# Altium project Altera256.PrjPcb
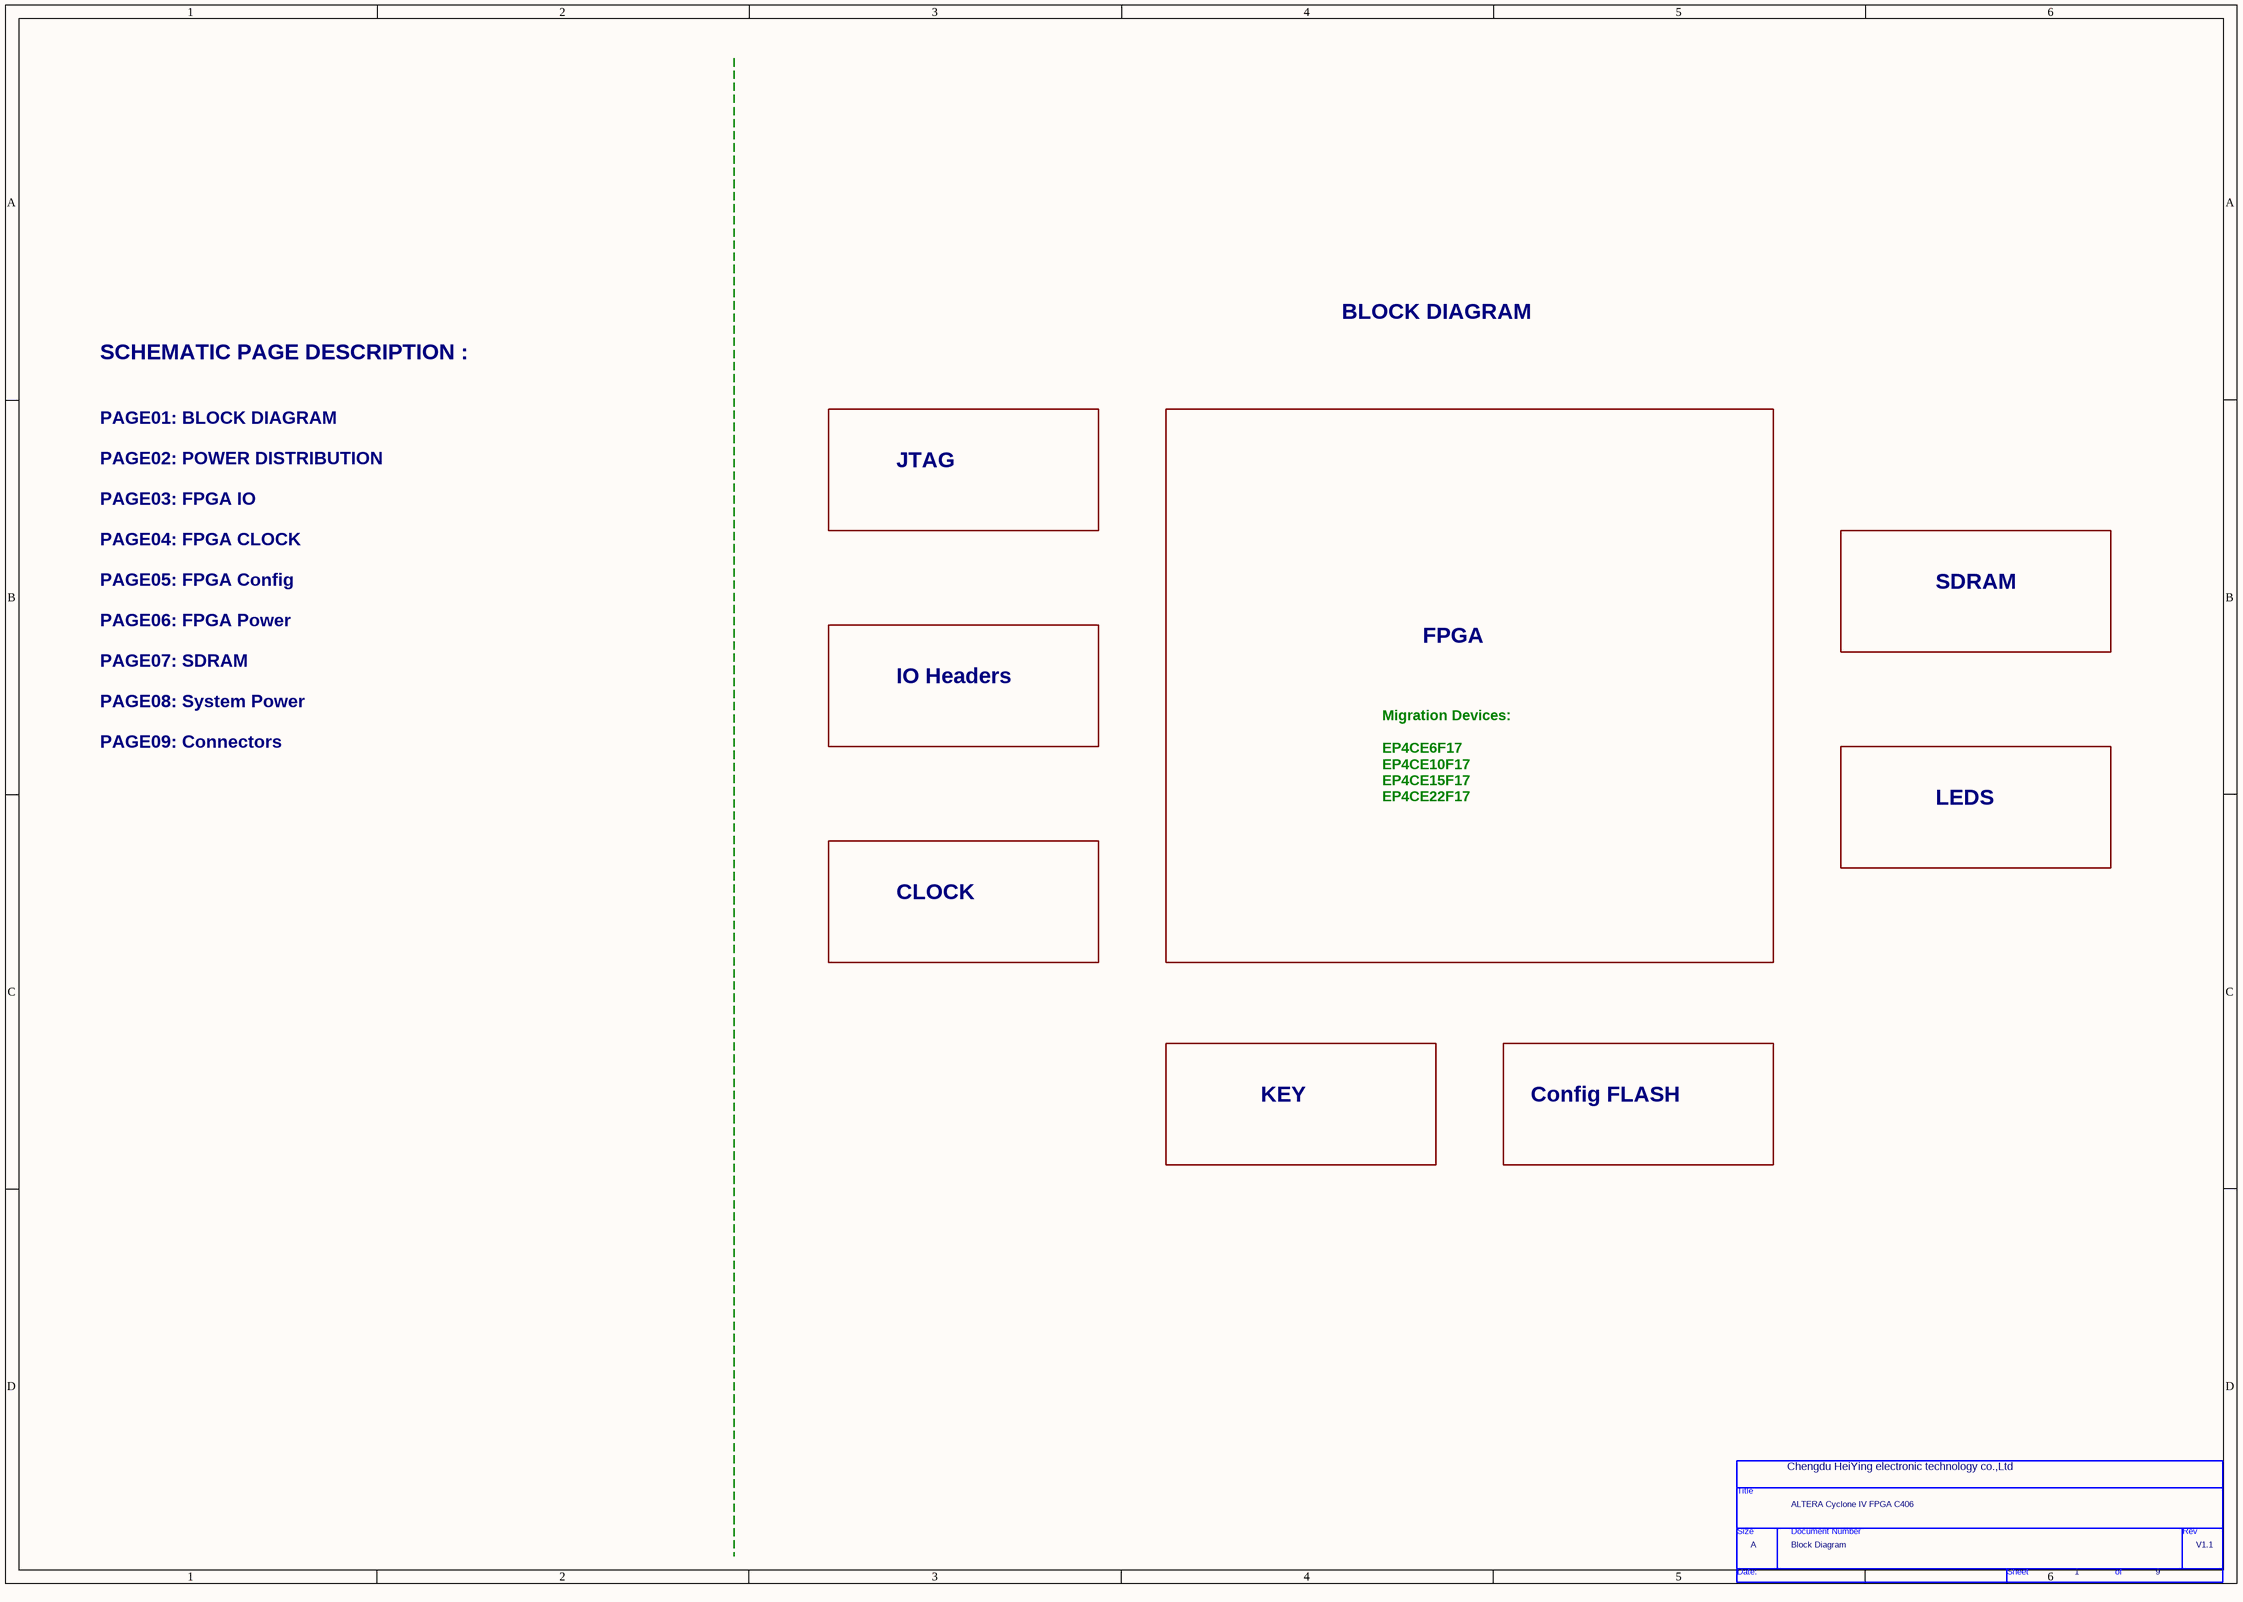
[diagram p0: PAGE01 BLOCK DIAGRAM.SchDoc]
9 sheets, 121 parts. Net scope: global (net labels, ports and power ports of the same name join across sheets).
Board file: C406_V163.PcbDoc
Sheets:
  PAGE01 BLOCK DIAGRAM.SchDoc
  PAGE02 POWER DISTRIBUTI.SchDoc
  PAGE03 FPGA IO.SchDoc
  PAGE04 FPGA CLOCK.SchDoc
  PAGE05 FPGA Config.SchDoc
  PAGE06 FPGA Power.SchDoc
  PAGE07 SDRAM.SchDoc
  PAGE08 System Power.SchDoc
  PAGE09 Connectors.SchDoc

## Sheet PAGE01 BLOCK DIAGRAM.SchDoc
size 420 x 297 mm; SheetNumber: 1; SheetTotal: 9

### Parts
(Parts that share a designator on the sheet are numbered #1, #2 ... from top to bottom, then left to right.)
*#1  Page Count: 9  Page Number: 1  Page Size: A  Title: ALTERA Cyclone IV FPGA C406  RevCode: V1.1  Doc: Block Diagram  (hidden comment: TitleBlock0)  (graphical)

### Notes on the sheet
- BLOCK DIAGRAM
- SCHEMATIC PAGE DESCRIPTION :
- PAGE01: BLOCK DIAGRAM
- PAGE02: POWER DISTRIBUTION
- PAGE03: FPGA IO
- JTAG
- PAGE04: FPGA CLOCK
- PAGE05: FPGA Config
- SDRAM
- PAGE06: FPGA Power
- PAGE07: SDRAM
- FPGA
- PAGE08: System Power
- IO Headers
- PAGE09: Connectors
- Migration Devices:
  EP4CE6F17
  EP4CE10F17
  EP4CE15F17
  EP4CE22F17
- LEDS
- CLOCK
- KEY
- Config FLASH
- (near *#1) Chengdu HeiYing electronic technology co.,Ltd
- (in symbol TitleBlock0) Title; Size; Document Number; Rev; Date:; Sheet; of

### Library data of the parts
*#1 = TitleBlock0: Page Create Date: March  8, 1995

## Sheet PAGE02 POWER DISTRIBUTI.SchDoc
size 420 x 297 mm; SheetNumber: 2; SheetTotal: 9
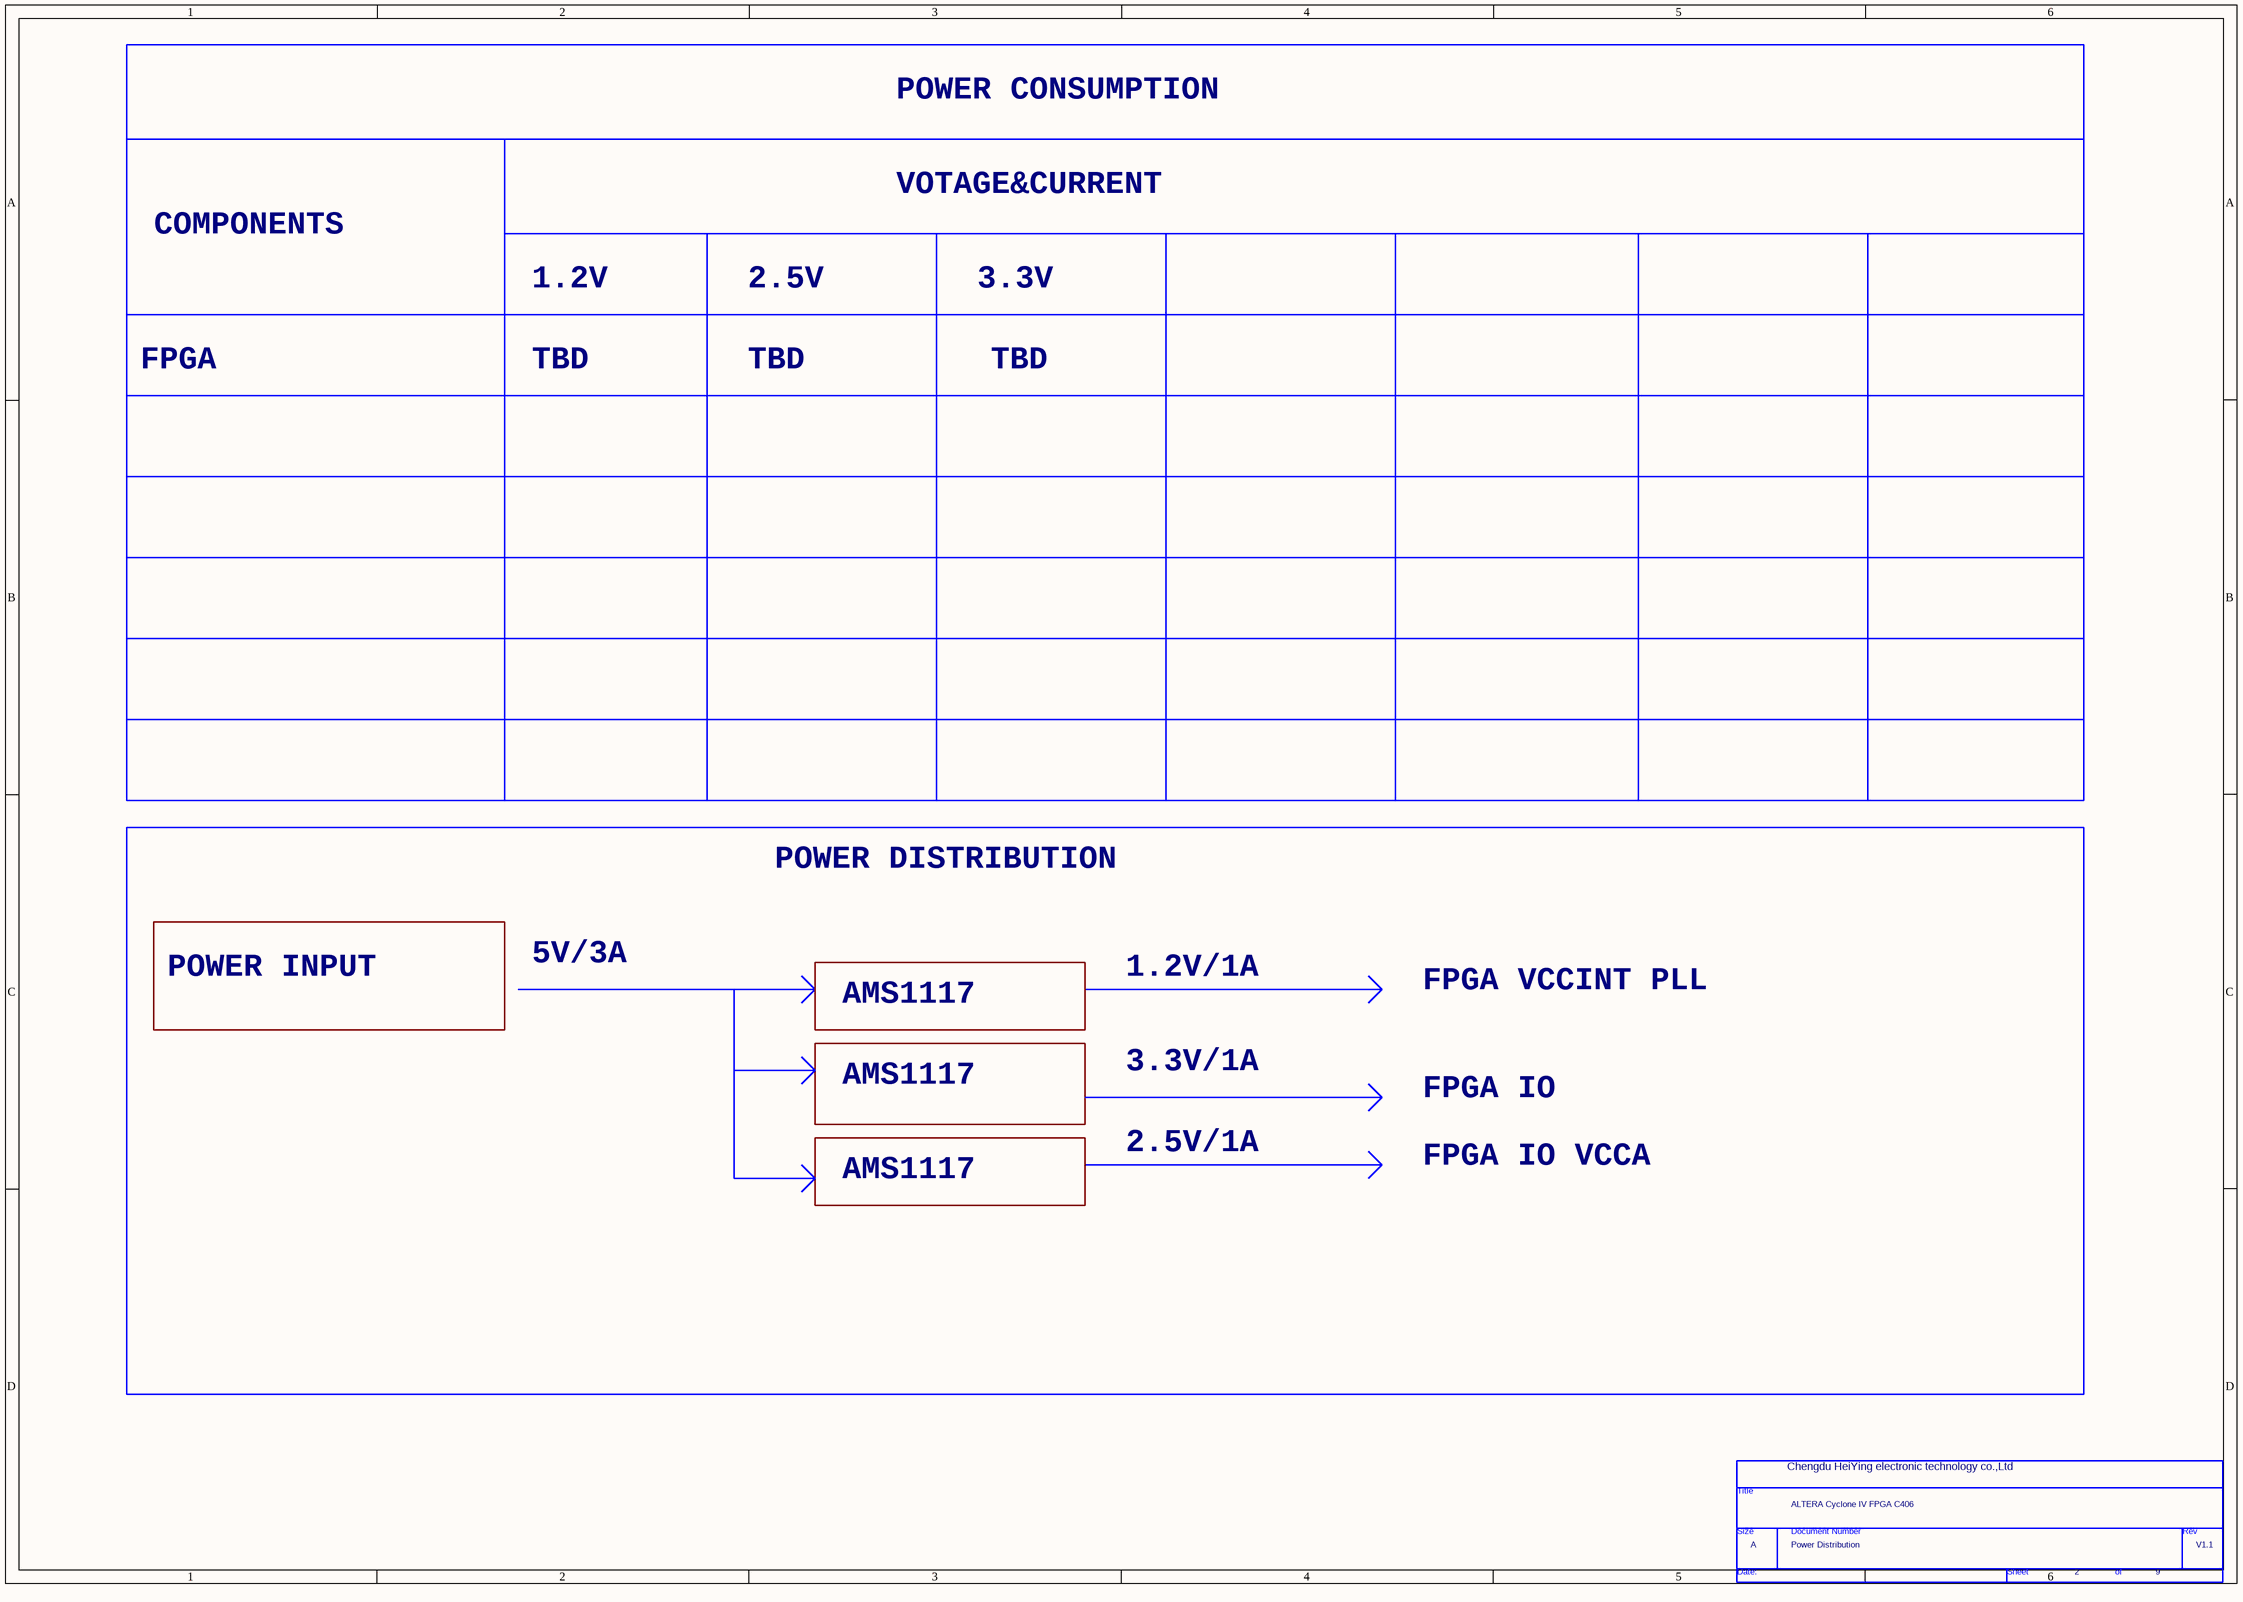
[diagram p1: PAGE02 POWER DISTRIBUTI.SchDoc]

### Parts
(Parts that share a designator on the sheet are numbered #1, #2 ... from top to bottom, then left to right.)
*#2  Page Count: 9  Page Number: 2  Page Size: A  Title: ALTERA Cyclone IV FPGA C406  RevCode: V1.1  Doc: Power Distribution  (hidden comment: TitleBlock0)  (graphical)

### Notes on the sheet
- POWER CONSUMPTION
- COMPONENTS
- VOTAGE&CURRENT
- 1.2V
- 2.5V
- 3.3V
- FPGA
- TBD
- POWER DISTRIBUTION
- POWER INPUT
- 5V/3A
- 1.2V/1A
- FPGA VCCINT PLL
- AMS1117
- 3.3V/1A
- FPGA IO
- 2.5V/1A
- FPGA IO VCCA
- (near *#2) Chengdu HeiYing electronic technology co.,Ltd
- (in symbol TitleBlock0) Title; Size; Document Number; Rev; Date:; Sheet; of

### Library data of the parts
*#2 = TitleBlock0: Page Create Date: March  8, 1995

## Sheet PAGE03 FPGA IO.SchDoc
size 420 x 297 mm; SheetNumber: 3; SheetTotal: 9
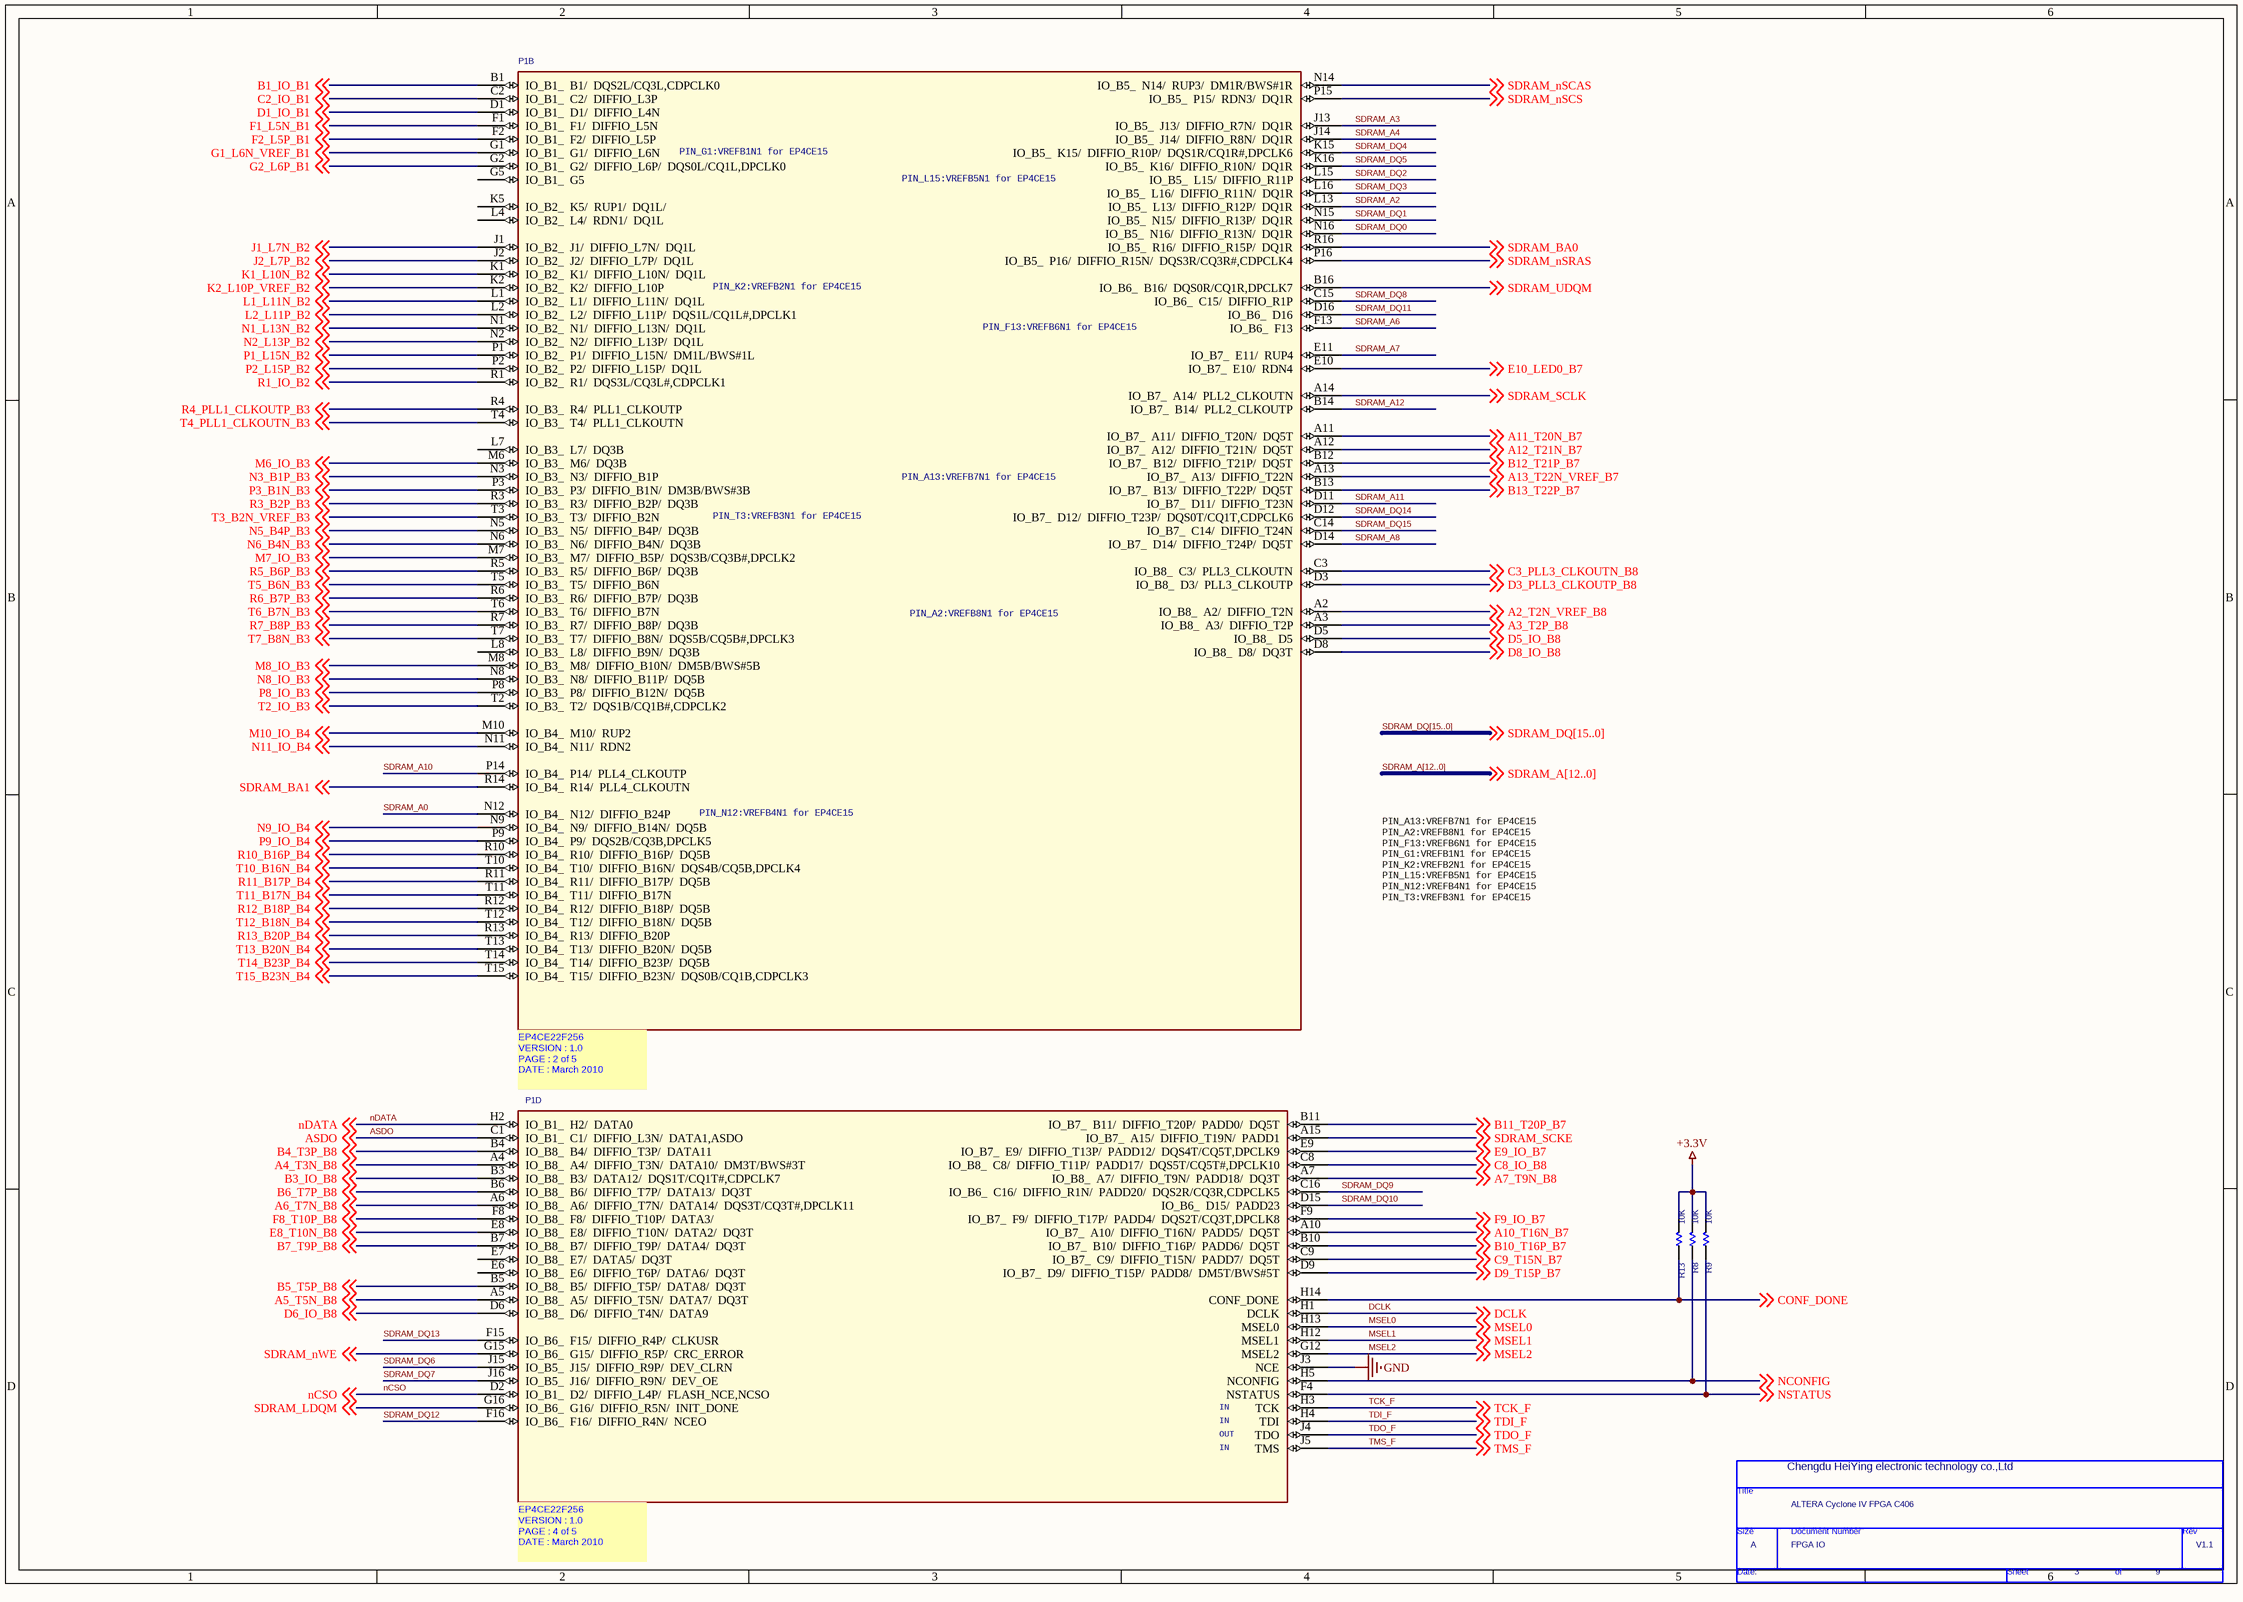
[diagram p2: PAGE03 FPGA IO.SchDoc]

### Parts
(Parts that share a designator on the sheet are numbered #1, #2 ... from top to bottom, then left to right.)
*#3  Page Count: 9  Page Number: 3  Page Size: A  Title: ALTERA Cyclone IV FPGA C406  RevCode: V1.1  Doc: FPGA IO  (hidden comment: TitleBlock0)  (graphical)
P1  EP4CE22F256  [fbga256_opt1]  (value not drawn)  (parts B,D of 5)
R8  10K  [R0402]
R9  10K  [R0402]
R13  10K  [R0402]

### Nets
+3.3V: R8.2 R9.2 R13.2
GND: P1.J3(NCE)
A2_T2N_VREF_B8: P1.A2(IO_B8___A2/__DIFFIO_T2N) ; off-sheet A2_T2N_VREF_B8
A3_T2P_B8: P1.A3(IO_B8___A3/__DIFFIO_T2P) ; off-sheet A3_T2P_B8
A4_T3N_B8: P1.A4(IO_B8___A4/__DIFFIO_T3N/__DATA10/__DM3T/BWS#3T) ; off-sheet A4_T3N_B8
A5_T5N_B8: P1.A5(IO_B8___A5/__DIFFIO_T5N/__DATA7/__DQ3T) ; off-sheet A5_T5N_B8
A6_T7N_B8: P1.A6(IO_B8___A6/__DIFFIO_T7N/__DATA14/__DQS3T/CQ3T#,DPCLK11) ; off-sheet A6_T7N_B8
A7_T9N_B8: P1.A7(IO_B8___A7/__DIFFIO_T9N/__PADD18/__DQ3T) ; off-sheet A7_T9N_B8
A10_T16N_B7: P1.A10(IO_B7___A10/__DIFFIO_T16N/__PADD5/__DQ5T) ; off-sheet A10_T16N_B7
A11_T20N_B7: P1.A11(IO_B7___A11/__DIFFIO_T20N/__DQ5T) ; off-sheet A11_T20N_B7
A12_T21N_B7: P1.A12(IO_B7___A12/__DIFFIO_T21N/__DQ5T) ; off-sheet A12_T21N_B7
A13_T22N_VREF_B7: P1.A13(IO_B7___A13/__DIFFIO_T22N) ; off-sheet A13_T22N_VREF_B7
ASDO: P1.C1(IO_B1___C1/__DIFFIO_L3N/__DATA1,ASDO) ; off-sheet ASDO
B1_IO_B1: P1.B1(IO_B1___B1/__DQS2L/CQ3L,CDPCLK0) ; off-sheet B1_IO_B1
B3_IO_B8: P1.B3(IO_B8___B3/__DATA12/__DQS1T/CQ1T#,CDPCLK7) ; off-sheet B3_IO_B8
B4_T3P_B8: P1.B4(IO_B8___B4/__DIFFIO_T3P/__DATA11) ; off-sheet B4_T3P_B8
B5_T5P_B8: P1.B5(IO_B8___B5/__DIFFIO_T5P/__DATA8/__DQ3T) ; off-sheet B5_T5P_B8
B6_T7P_B8: P1.B6(IO_B8___B6/__DIFFIO_T7P/__DATA13/__DQ3T) ; off-sheet B6_T7P_B8
B7_T9P_B8: P1.B7(IO_B8___B7/__DIFFIO_T9P/__DATA4/__DQ3T) ; off-sheet B7_T9P_B8
B10_T16P_B7: P1.B10(IO_B7___B10/__DIFFIO_T16P/__PADD6/__DQ5T) ; off-sheet B10_T16P_B7
B11_T20P_B7: P1.B11(IO_B7___B11/__DIFFIO_T20P/__PADD0/__DQ5T) ; off-sheet B11_T20P_B7
B12_T21P_B7: P1.B12(IO_B7___B12/__DIFFIO_T21P/__DQ5T) ; off-sheet B12_T21P_B7
B13_T22P_B7: P1.B13(IO_B7___B13/__DIFFIO_T22P/__DQ5T) ; off-sheet B13_T22P_B7
C2_IO_B1: P1.C2(IO_B1___C2/__DIFFIO_L3P) ; off-sheet C2_IO_B1
C3_PLL3_CLKOUTN_B8: P1.C3(IO_B8___C3/__PLL3_CLKOUTN) ; off-sheet C3_PLL3_CLKOUTN_B8
C8_IO_B8: P1.C8(IO_B8___C8/__DIFFIO_T11P/__PADD17/__DQS5T/CQ5T#,DPCLK10) ; off-sheet C8_IO_B8
C9_T15N_B7: P1.C9(IO_B7___C9/__DIFFIO_T15N/__PADD7/__DQ5T) ; off-sheet C9_T15N_B7
CONF_DONE: P1.H14(CONF_DONE) R13.1 ; off-sheet CONF_DONE
D1_IO_B1: P1.D1(IO_B1___D1/__DIFFIO_L4N) ; off-sheet D1_IO_B1
D3_PLL3_CLKOUTP_B8: P1.D3(IO_B8___D3/__PLL3_CLKOUTP) ; off-sheet D3_PLL3_CLKOUTP_B8
D5_IO_B8: P1.D5(IO_B8___D5) ; off-sheet D5_IO_B8
D6_IO_B8: P1.D6(IO_B8___D6/__DIFFIO_T4N/__DATA9) ; off-sheet D6_IO_B8
D8_IO_B8: P1.D8(IO_B8___D8/__DQ3T) ; off-sheet D8_IO_B8
D9_T15P_B7: P1.D9(IO_B7___D9/__DIFFIO_T15P/__PADD8/__DM5T/BWS#5T) ; off-sheet D9_T15P_B7
DCLK: P1.H1(DCLK) ; off-sheet DCLK
E8_T10N_B8: P1.E8(IO_B8___E8/__DIFFIO_T10N/__DATA2/__DQ3T) ; off-sheet E8_T10N_B8
E9_IO_B7: P1.E9(IO_B7___E9/__DIFFIO_T13P/__PADD12/__DQS4T/CQ5T,DPCLK9) ; off-sheet E9_IO_B7
E10_LED0_B7: P1.E10(IO_B7___E10/__RDN4) ; off-sheet E10_LED0_B7
F1_L5N_B1: P1.F1(IO_B1___F1/__DIFFIO_L5N) ; off-sheet F1_L5N_B1
F2_L5P_B1: P1.F2(IO_B1___F2/__DIFFIO_L5P) ; off-sheet F2_L5P_B1
F8_T10P_B8: P1.F8(IO_B8___F8/__DIFFIO_T10P/__DATA3/) ; off-sheet F8_T10P_B8
F9_IO_B7: P1.F9(IO_B7___F9/__DIFFIO_T17P/__PADD4/__DQS2T/CQ3T,DPCLK8) ; off-sheet F9_IO_B7
G1_L6N_VREF_B1: P1.G1(IO_B1___G1/__DIFFIO_L6N) ; off-sheet G1_L6N_VREF_B1
G2_L6P_B1: P1.G2(IO_B1___G2/__DIFFIO_L6P/__DQS0L/CQ1L,DPCLK0) ; off-sheet G2_L6P_B1
J1_L7N_B2: P1.J1(IO_B2___J1/__DIFFIO_L7N/__DQ1L) ; off-sheet J1_L7N_B2
J2_L7P_B2: P1.J2(IO_B2___J2/__DIFFIO_L7P/__DQ1L) ; off-sheet J2_L7P_B2
K1_L10N_B2: P1.K1(IO_B2___K1/__DIFFIO_L10N/__DQ1L) ; off-sheet K1_L10N_B2
K2_L10P_VREF_B2: P1.K2(IO_B2___K2/__DIFFIO_L10P) ; off-sheet K2_L10P_VREF_B2
L1_L11N_B2: P1.L1(IO_B2___L1/__DIFFIO_L11N/__DQ1L) ; off-sheet L1_L11N_B2
L2_L11P_B2: P1.L2(IO_B2___L2/__DIFFIO_L11P/__DQS1L/CQ1L#,DPCLK1) ; off-sheet L2_L11P_B2
M6_IO_B3: P1.M6(IO_B3___M6/__DQ3B) ; off-sheet M6_IO_B3
M7_IO_B3: P1.M7(IO_B3___M7/__DIFFIO_B5P/__DQS3B/CQ3B#,DPCLK2) ; off-sheet M7_IO_B3
M8_IO_B3: P1.M8(IO_B3___M8/__DIFFIO_B10N/__DM5B/BWS#5B) ; off-sheet M8_IO_B3
M10_IO_B4: P1.M10(IO_B4___M10/__RUP2) ; off-sheet M10_IO_B4
MSEL0: P1.H13(MSEL0) ; off-sheet MSEL0
MSEL1: P1.H12(MSEL1) ; off-sheet MSEL1
MSEL2: P1.G12(MSEL2) ; off-sheet MSEL2
N1_L13N_B2: P1.N1(IO_B2___N1/__DIFFIO_L13N/__DQ1L) ; off-sheet N1_L13N_B2
N2_L13P_B2: P1.N2(IO_B2___N2/__DIFFIO_L13P/__DQ1L) ; off-sheet N2_L13P_B2
N3_B1P_B3: P1.N3(IO_B3___N3/__DIFFIO_B1P) ; off-sheet N3_B1P_B3
N5_B4P_B3: P1.N5(IO_B3___N5/__DIFFIO_B4P/__DQ3B) ; off-sheet N5_B4P_B3
N6_B4N_B3: P1.N6(IO_B3___N6/__DIFFIO_B4N/__DQ3B) ; off-sheet N6_B4N_B3
N8_IO_B3: P1.N8(IO_B3___N8/__DIFFIO_B11P/__DQ5B) ; off-sheet N8_IO_B3
N9_IO_B4: P1.N9(IO_B4___N9/__DIFFIO_B14N/__DQ5B) ; off-sheet N9_IO_B4
N11_IO_B4: P1.N11(IO_B4___N11/__RDN2) ; off-sheet N11_IO_B4
NCONFIG: P1.H5(NCONFIG) R8.1 ; off-sheet NCONFIG
nCSO: P1.D2(IO_B1___D2/__DIFFIO_L4P/__FLASH_NCE,NCSO) ; off-sheet nCSO
nDATA: P1.H2(IO_B1___H2/__DATA0) ; off-sheet nDATA
NSTATUS: P1.F4(NSTATUS) R9.1 ; off-sheet NSTATUS
P1_L15N_B2: P1.P1(IO_B2___P1/__DIFFIO_L15N/__DM1L/BWS#1L) ; off-sheet P1_L15N_B2
P2_L15P_B2: P1.P2(IO_B2___P2/__DIFFIO_L15P/__DQ1L) ; off-sheet P2_L15P_B2
P3_B1N_B3: P1.P3(IO_B3___P3/__DIFFIO_B1N/__DM3B/BWS#3B) ; off-sheet P3_B1N_B3
P8_IO_B3: P1.P8(IO_B3___P8/__DIFFIO_B12N/__DQ5B) ; off-sheet P8_IO_B3
P9_IO_B4: P1.P9(IO_B4___P9/__DQS2B/CQ3B,DPCLK5) ; off-sheet P9_IO_B4
R1_IO_B2: P1.R1(IO_B2___R1/__DQS3L/CQ3L#,CDPCLK1) ; off-sheet R1_IO_B2
R3_B2P_B3: P1.R3(IO_B3___R3/__DIFFIO_B2P/__DQ3B) ; off-sheet R3_B2P_B3
R4_PLL1_CLKOUTP_B3: P1.R4(IO_B3___R4/__PLL1_CLKOUTP) ; off-sheet R4_PLL1_CLKOUTP_B3
R5_B6P_B3: P1.R5(IO_B3___R5/__DIFFIO_B6P/__DQ3B) ; off-sheet R5_B6P_B3
R6_B7P_B3: P1.R6(IO_B3___R6/__DIFFIO_B7P/__DQ3B) ; off-sheet R6_B7P_B3
R7_B8P_B3: P1.R7(IO_B3___R7/__DIFFIO_B8P/__DQ3B) ; off-sheet R7_B8P_B3
R10_B16P_B4: P1.R10(IO_B4___R10/__DIFFIO_B16P/__DQ5B) ; off-sheet R10_B16P_B4
R11_B17P_B4: P1.R11(IO_B4___R11/__DIFFIO_B17P/__DQ5B) ; off-sheet R11_B17P_B4
R12_B18P_B4: P1.R12(IO_B4___R12/__DIFFIO_B18P/__DQ5B) ; off-sheet R12_B18P_B4
R13_B20P_B4: P1.R13(IO_B4___R13/__DIFFIO_B20P) ; off-sheet R13_B20P_B4
SDRAM_A0: P1.N12(IO_B4___N12/__DIFFIO_B24P)
SDRAM_A2: P1.L13(IO_B5___L13/__DIFFIO_R12P/__DQ1R)
SDRAM_A3: P1.J13(IO_B5___J13/__DIFFIO_R7N/__DQ1R)
SDRAM_A4: P1.J14(IO_B5___J14/__DIFFIO_R8N/__DQ1R)
SDRAM_A6: P1.F13(IO_B6___F13)
SDRAM_A7: P1.E11(IO_B7___E11/__RUP4)
SDRAM_A8: P1.D14(IO_B7___D14/__DIFFIO_T24P/__DQ5T)
SDRAM_A10: P1.P14(IO_B4___P14/__PLL4_CLKOUTP)
SDRAM_A11: P1.D11(IO_B7___D11/__DIFFIO_T23N)
SDRAM_A12: P1.B14(IO_B7___B14/__PLL2_CLKOUTP)
SDRAM_BA0: P1.R16(IO_B5___R16/__DIFFIO_R15P/__DQ1R) ; off-sheet SDRAM_BA0
SDRAM_BA1: P1.R14(IO_B4___R14/__PLL4_CLKOUTN) ; off-sheet SDRAM_BA1
SDRAM_DQ0: P1.N16(IO_B5___N16/__DIFFIO_R13N/__DQ1R)
SDRAM_DQ1: P1.N15(IO_B5___N15/__DIFFIO_R13P/__DQ1R)
SDRAM_DQ2: P1.L15(IO_B5___L15/__DIFFIO_R11P)
SDRAM_DQ3: P1.L16(IO_B5___L16/__DIFFIO_R11N/__DQ1R)
SDRAM_DQ4: P1.K15(IO_B5___K15/__DIFFIO_R10P/__DQS1R/CQ1R#,DPCLK6)
SDRAM_DQ5: P1.K16(IO_B5___K16/__DIFFIO_R10N/__DQ1R)
SDRAM_DQ6: P1.J15(IO_B5___J15/__DIFFIO_R9P/__DEV_CLRN)
SDRAM_DQ7: P1.J16(IO_B5___J16/__DIFFIO_R9N/__DEV_OE)
SDRAM_DQ8: P1.C15(IO_B6___C15/__DIFFIO_R1P)
SDRAM_DQ9: P1.C16(IO_B6___C16/__DIFFIO_R1N/__PADD20/__DQS2R/CQ3R,CDPCLK5)
SDRAM_DQ10: P1.D15(IO_B6___D15/__PADD23)
SDRAM_DQ11: P1.D16(IO_B6___D16)
SDRAM_DQ12: P1.F16(IO_B6___F16/__DIFFIO_R4N/__NCEO)
SDRAM_DQ13: P1.F15(IO_B6___F15/__DIFFIO_R4P/__CLKUSR)
SDRAM_DQ14: P1.D12(IO_B7___D12/__DIFFIO_T23P/__DQS0T/CQ1T,CDPCLK6)
SDRAM_DQ15: P1.C14(IO_B7___C14/__DIFFIO_T24N)
SDRAM_LDQM: P1.G16(IO_B6___G16/__DIFFIO_R5N/__INIT_DONE) ; off-sheet SDRAM_LDQM
SDRAM_nSCAS: P1.N14(IO_B5___N14/__RUP3/__DM1R/BWS#1R) ; off-sheet SDRAM_nSCAS
SDRAM_nSCS: P1.P15(IO_B5___P15/__RDN3/__DQ1R) ; off-sheet SDRAM_nSCS
SDRAM_nSRAS: P1.P16(IO_B5___P16/__DIFFIO_R15N/__DQS3R/CQ3R#,CDPCLK4) ; off-sheet SDRAM_nSRAS
SDRAM_nWE: P1.G15(IO_B6___G15/__DIFFIO_R5P/__CRC_ERROR) ; off-sheet SDRAM_nWE
SDRAM_SCKE: P1.A15(IO_B7___A15/__DIFFIO_T19N/__PADD1) ; off-sheet SDRAM_SCKE
SDRAM_SCLK: P1.A14(IO_B7___A14/__PLL2_CLKOUTN) ; off-sheet SDRAM_SCLK
SDRAM_UDQM: P1.B16(IO_B6___B16/__DQS0R/CQ1R,DPCLK7) ; off-sheet SDRAM_UDQM
T2_IO_B3: P1.T2(IO_B3___T2/__DQS1B/CQ1B#,CDPCLK2) ; off-sheet T2_IO_B3
T3_B2N_VREF_B3: P1.T3(IO_B3___T3/__DIFFIO_B2N) ; off-sheet T3_B2N_VREF_B3
T4_PLL1_CLKOUTN_B3: P1.T4(IO_B3___T4/__PLL1_CLKOUTN) ; off-sheet T4_PLL1_CLKOUTN_B3
T5_B6N_B3: P1.T5(IO_B3___T5/__DIFFIO_B6N) ; off-sheet T5_B6N_B3
T6_B7N_B3: P1.T6(IO_B3___T6/__DIFFIO_B7N) ; off-sheet T6_B7N_B3
T7_B8N_B3: P1.T7(IO_B3___T7/__DIFFIO_B8N/__DQS5B/CQ5B#,DPCLK3) ; off-sheet T7_B8N_B3
T10_B16N_B4: P1.T10(IO_B4___T10/__DIFFIO_B16N/__DQS4B/CQ5B,DPCLK4) ; off-sheet T10_B16N_B4
T11_B17N_B4: P1.T11(IO_B4___T11/__DIFFIO_B17N) ; off-sheet T11_B17N_B4
T12_B18N_B4: P1.T12(IO_B4___T12/__DIFFIO_B18N/__DQ5B) ; off-sheet T12_B18N_B4
T13_B20N_B4: P1.T13(IO_B4___T13/__DIFFIO_B20N/__DQ5B) ; off-sheet T13_B20N_B4
T14_B23P_B4: P1.T14(IO_B4___T14/__DIFFIO_B23P/__DQ5B) ; off-sheet T14_B23P_B4
T15_B23N_B4: P1.T15(IO_B4___T15/__DIFFIO_B23N/__DQS0B/CQ1B,CDPCLK3) ; off-sheet T15_B23N_B4
TCK_F: P1.H3(TCK) ; off-sheet TCK_F
TDI_F: P1.H4(TDI) ; off-sheet TDI_F
TDO_F: P1.J4(TDO) ; off-sheet TDO_F
TMS_F: P1.J5(TMS) ; off-sheet TMS_F

Not connected (* = marked no-connect by the designer): P1 E6(IO_B8___E6/__DIFFIO_T6P/__DATA6/__DQ3T) E7(IO_B8___E7/__DATA5/__DQ3T) G5(IO_B1___G5) K5(IO_B2___K5/__RUP1/__DQ1L/) L4(IO_B2___L4/__RDN1/__DQ1L) L7(IO_B3___L7/__DQ3B) L8(IO_B3___L8/__DIFFIO_B9N/__DQ3B)

### Buses and harness runs
bus SDRAM_A[12..0]
bus SDRAM_DQ[15..0]

### Notes on the sheet
- (near P1) PIN_G1:VREFB1N1 for EP4CE15
- (near P1) PIN_L15:VREFB5N1 for EP4CE15
- (near P1) PIN_K2:VREFB2N1 for EP4CE15
- (near P1) PIN_F13:VREFB6N1 for EP4CE15
- (near P1) PIN_T3:VREFB3N1 for EP4CE15
- (near P1) PIN_A13:VREFB7N1 for EP4CE15
- (near P1) PIN_A2:VREFB8N1 for EP4CE15
- (near P1) PIN_N12:VREFB4N1 for EP4CE15
- PIN_A13:VREFB7N1 for EP4CE15
  PIN_A2:VREFB8N1 for EP4CE15
  PIN_F13:VREFB6N1 for EP4CE15
  PIN_G1:VREFB1N1 for EP4CE15
  PIN_K2:VREFB2N1 for EP4CE15
  PIN_L15:VREFB5N1 for EP4CE15
  PIN_N12:VREFB4N1 for EP4CE15
  PIN_T3:VREFB3N1 for EP4CE15
- (near P1) IN
- (near P1) OUT
- (near *#3) Chengdu HeiYing electronic technology co.,Ltd
- (in symbol EP4CE22F256, part B) EP4CE22F256 / VERSION : 1.0 / PAGE : 2 of 5 / DATE : March 2010 /
- (in symbol EP4CE22F256, part D) EP4CE22F256 / VERSION : 1.0 / PAGE : 4 of 5 / DATE : March 2010 /
- (in symbol TitleBlock0) Title; Size; Document Number; Rev; Date:; Sheet; of

### Library data of the parts
P1 = EP4CE22F256: SWAP_INFO: (S1+S2+S3+S4+S5); SPLIT_INST: TRUE
R8 R9 R13 = SMALL R1
*#3 = TitleBlock0: Page Create Date: March  8, 1995

## Sheet PAGE04 FPGA CLOCK.SchDoc
size 246 x 182 mm; SheetNumber: 4; SheetTotal: 9
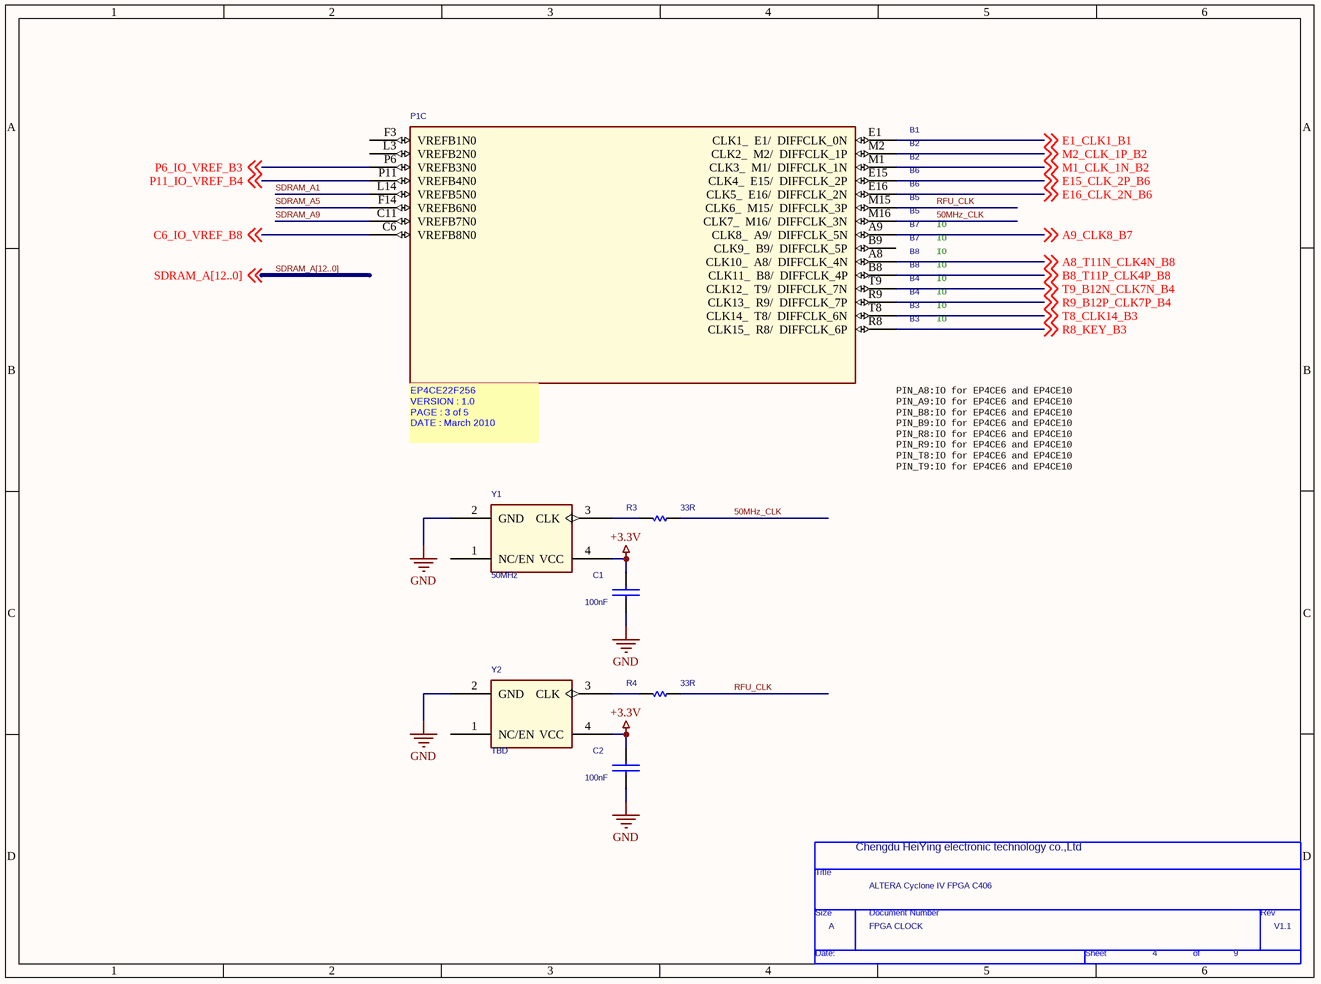
[diagram p3: PAGE04 FPGA CLOCK.SchDoc]

### Parts
(Parts that share a designator on the sheet are numbered #1, #2 ... from top to bottom, then left to right.)
*#4  Page Count: 9  Page Number: 4  Page Size: A  Title: ALTERA Cyclone IV FPGA C406  RevCode: V1.1  Doc: FPGA CLOCK  (hidden comment: TitleBlock0)  (graphical)
C1  100nF  [C0402]
C2  100nF  [C0402]
P1  EP4CE22F256  [fbga256_opt1]  (value not drawn)  (part C of 5)
R3  33R  [R0402]
R4  33R  [R0402]
Y1  50MHz  [OSC3225]
Y2  TBD  [OSC3225]

### Nets
+3.3V: C1.1 C2.1 Y1.4(VCC) Y2.4(VCC)
GND: C1.2 C2.2 Y1.2(GND) Y2.2(GND)
50MHz_CLK: P1.M16(CLK7___M16/__DIFFCLK_3N) R3.1
A8_T11N_CLK4N_B8: P1.A8(CLK10___A8/__DIFFCLK_4N) ; off-sheet A8_T11N_CLK4N_B8
A9_CLK8_B7: P1.A9(CLK8___A9/__DIFFCLK_5N) ; off-sheet A9_CLK8_B7
B8_T11P_CLK4P_B8: P1.B8(CLK11___B8/__DIFFCLK_4P) ; off-sheet B8_T11P_CLK4P_B8
C6_IO_VREF_B8: P1.C6(VREFB8N0) ; off-sheet C6_IO_VREF_B8
E1_CLK1_B1: P1.E1(CLK1___E1/__DIFFCLK_0N) ; off-sheet E1_CLK1_B1
E15_CLK_2P_B6: P1.E15(CLK4___E15/__DIFFCLK_2P) ; off-sheet E15_CLK_2P_B6
E16_CLK_2N_B6: P1.E16(CLK5___E16/__DIFFCLK_2N) ; off-sheet E16_CLK_2N_B6
M1_CLK_1N_B2: P1.M1(CLK3___M1/__DIFFCLK_1N) ; off-sheet M1_CLK_1N_B2
M2_CLK_1P_B2: P1.M2(CLK2___M2/__DIFFCLK_1P) ; off-sheet M2_CLK_1P_B2
P6_IO_VREF_B3: P1.P6(VREFB3N0) ; off-sheet P6_IO_VREF_B3
P11_IO_VREF_B4: P1.P11(VREFB4N0) ; off-sheet P11_IO_VREF_B4
R8_KEY_B3: P1.R8(CLK15___R8/__DIFFCLK_6P) ; off-sheet R8_KEY_B3
R9_B12P_CLK7P_B4: P1.R9(CLK13___R9/__DIFFCLK_7P) ; off-sheet R9_B12P_CLK7P_B4
RFU_CLK: P1.M15(CLK6___M15/__DIFFCLK_3P) R4.1
SDRAM_A1: P1.L14(VREFB5N0)
SDRAM_A5: P1.F14(VREFB6N0)
SDRAM_A9: P1.C11(VREFB7N0)
T8_CLK14_B3: P1.T8(CLK14___T8/__DIFFCLK_6N) ; off-sheet T8_CLK14_B3
T9_B12N_CLK7N_B4: P1.T9(CLK12___T9/__DIFFCLK_7N) ; off-sheet T9_B12N_CLK7N_B4
NetR3_2: R3.2 Y1.3(CLK)
NetR4_2: R4.2 Y2.3(CLK)

Not connected (* = marked no-connect by the designer): P1 B9(CLK9___B9/__DIFFCLK_5P) F3(VREFB1N0) L3(VREFB2N0); Y1 1(NC/EN); Y2 1(NC/EN)

### Buses and harness runs
bus SDRAM_A[12..0]

### Notes on the sheet
- B1
- B2
- B6
- B5
- B7
- B8
- IO
- B4
- B3
- PIN_A8:IO for EP4CE6 and EP4CE10
  PIN_A9:IO for EP4CE6 and EP4CE10
  PIN_B8:IO for EP4CE6 and EP4CE10
  PIN_B9:IO for EP4CE6 and EP4CE10
  PIN_R8:IO for EP4CE6 and EP4CE10
  PIN_R9:IO for EP4CE6 and EP4CE10
  PIN_T8:IO for EP4CE6 and EP4CE10
  PIN_T9:IO for EP4CE6 and EP4CE10
- (near *#4) Chengdu HeiYing electronic technology co.,Ltd
- (in symbol EP4CE22F256, part C) EP4CE22F256 / VERSION : 1.0 / PAGE : 3 of 5 / DATE : March 2010 /
- (in symbol TitleBlock0) Title; Size; Document Number; Rev; Date:; Sheet; of

### Library data of the parts
C1 C2 = CAP_0: CAP CER .1UF 16V X7R 0402; MANUFACTURER: MURATA; MANUFACTURER P/N: GRM155R71C104KA88D; ROOM: PHY&FPGA; DISTRIBUTOR: DIGIKEY; PRICE: 0.00300; DIELECTRIC: X7R; DISTRIBUTOR P/N: 490-3261-1-ND
P1 = EP4CE22F256: as P1 on sheet PAGE03 FPGA IO
R3 R4 = SMALL R1
Y1 Y2 = OSCILLATOR_0: ROOM: PHY&FPGA
*#4 = TitleBlock0: Page Create Date: March  8, 1995

## Sheet PAGE05 FPGA Config.SchDoc
size 297 x 209 mm; SheetNumber: 5; SheetTotal: 9
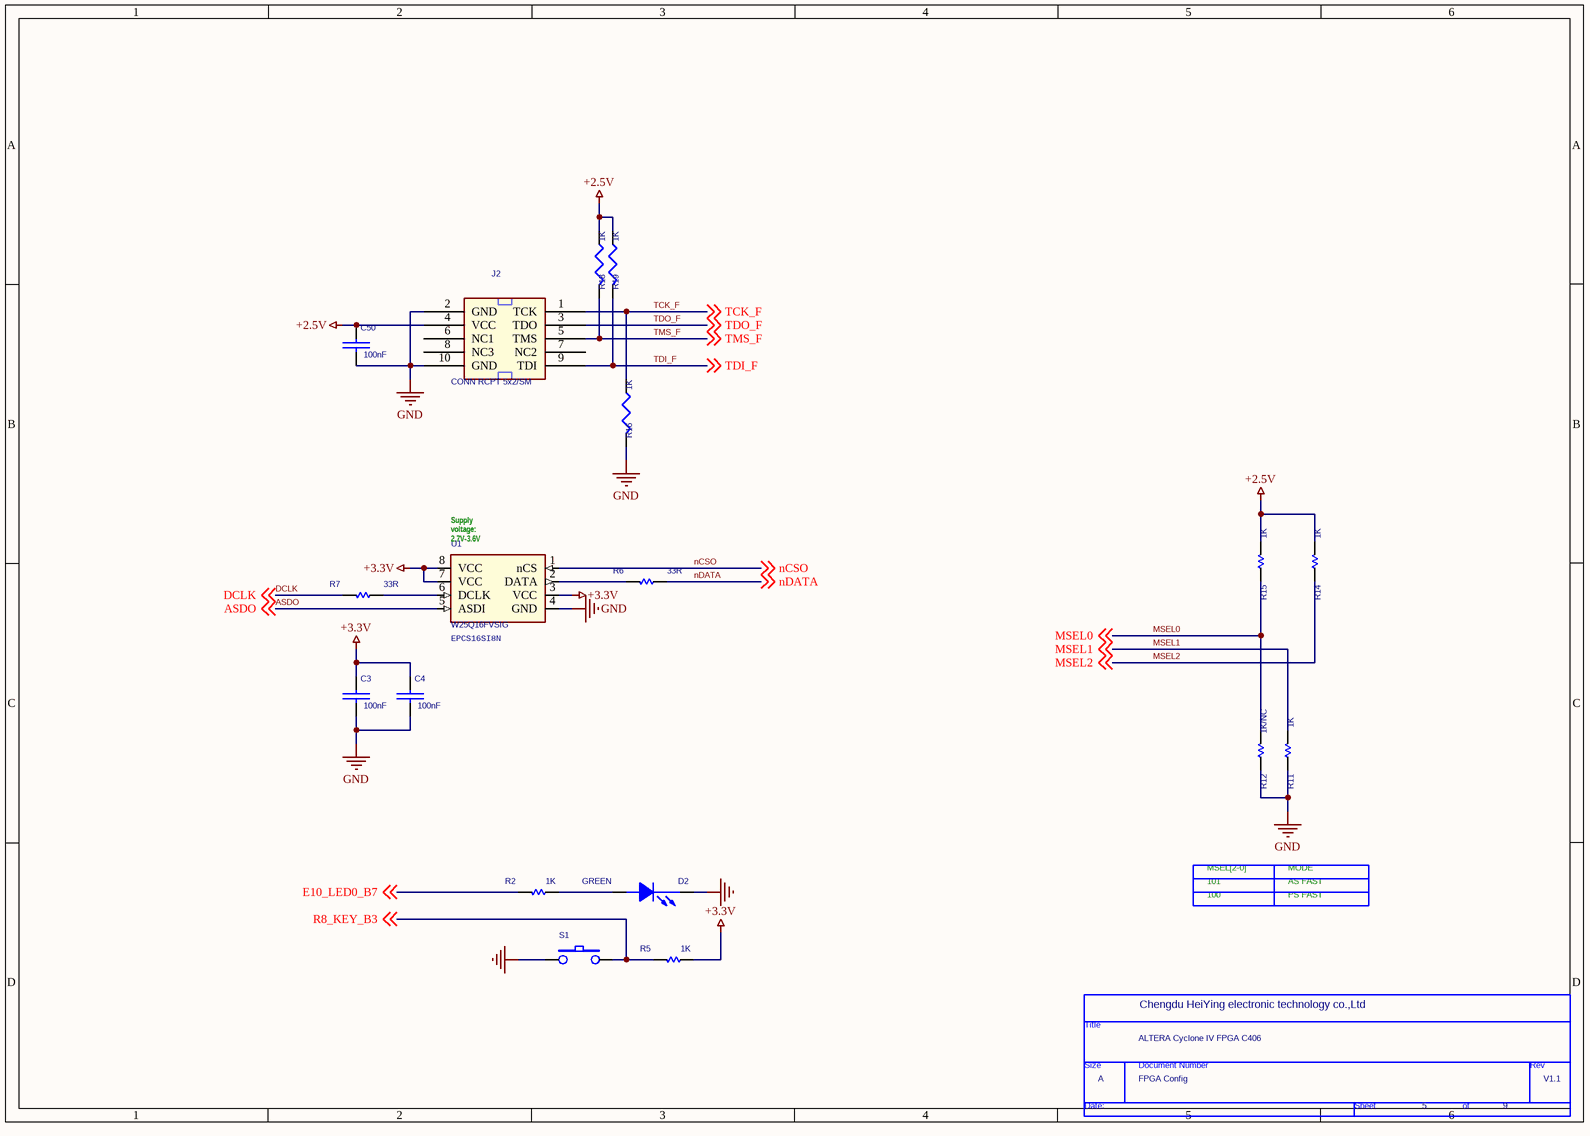
[diagram p4: PAGE05 FPGA Config.SchDoc]

### Parts
(Parts that share a designator on the sheet are numbered #1, #2 ... from top to bottom, then left to right.)
*#5  Page Count: 9  Page Number: 5  Page Size: A  Title: ALTERA Cyclone IV FPGA C406  RevCode: V1.1  Doc: FPGA Config  (hidden comment: TitleBlock0)  (graphical)
C3  100nF  [C0402]
C4  100nF  [C0402]
C50  100nF  [C0402]
D2  GREEN  [Q0603]
J2  CONN RCPT 5x2/SM  [DIP10-2P54-I]
R2  1K  [R0402]
R5  1K  [R0402]
R6  33R  [R0402]
R7  33R  [R0402]
R11  1K  [R0402]
R12  1K/NC  [R0402]
R14  1K  [R0402]
R15  1K  [R0402]
R16  1K  [R0402]
R18  1K  [R0402]
R19  1K  [R0402]
S1  FSMRA2JH  [SMD_3X4X2MM]  (value not drawn)
U1  W25Q16FVSIG  [SOIC8_1P27_208MIL]

### Nets
+2.5V: C50.1 J2.4(VCC) R14.2 R15.2 R18.1 R19.1
+3.3V: C3.1 C4.1 R5.1 U1.3(VCC) U1.7(VCC) U1.8(VCC)
GND: C3.2 C4.2 C50.2 D2.2(CATHODE) J2.2(GND) J2.10(GND) R11.1 R12.1 R16.2 S1.2 U1.4(GND)
ASDO: U1.5(ASDI) ; off-sheet ASDO
DCLK: R7.2 ; off-sheet DCLK
E10_LED0_B7: R2.2 ; off-sheet E10_LED0_B7
MSEL0: R12.2 R15.1 ; off-sheet MSEL0
MSEL1: R11.2 ; off-sheet MSEL1
MSEL2: R14.1 ; off-sheet MSEL2
nCSO: U1.1(nCS) ; off-sheet nCSO
nDATA: R6.1 ; off-sheet nDATA
R8_KEY_B3: R5.2 S1.1 ; off-sheet R8_KEY_B3
TCK_F: J2.1(TCK) R16.1 ; off-sheet TCK_F
TDI_F: J2.9(TDI) R19.2 ; off-sheet TDI_F
TDO_F: J2.3(TDO) ; off-sheet TDO_F
TMS_F: J2.5(TMS) R18.2 ; off-sheet TMS_F
NetD2_1: D2.1(ANODE) R2.1
NetR6_2: R6.2 U1.2(DATA)
NetR7_1: R7.1 U1.6(DCLK)

Not connected (* = marked no-connect by the designer): J2 6(NC1) 7(NC2) 8(NC3)

### Notes on the sheet
- (near U1) Supply
  voltage:
  2.7V-3.6V
- (near U1) EPCS16SI8N
- MSEL[2-0]
- MODE
- 101
- 100
- AS FAST
- PS FAST
- Chengdu HeiYing electronic technology co.,Ltd
- (in symbol TitleBlock0) Title; Size; Document Number; Rev; Date:; Sheet; of

### Library data of the parts
C3 C4 C50 = CAP_0: as C1 on sheet PAGE04 FPGA CLOCK; DISTRIBUTOR: DIGIKEY; PRICE: 0.00300; DIELECTRIC: X7R; DISTRIBUTOR P/N: 490-3261-1-ND
D2 = LED: ROOM: POWER
J2 = CONN RCPT 5x2/SM_0
R2 R5-R7 R11 R12 R14 R15 = SMALL R1
R16 R18 R19 = R_6
S1 = SWITCH_2: SWITCH TACT RA H=3.86MM 160GF; MANUFACTURER: TYCO; ROOM: CPU; MANUFACTURER P/N: FSMRA2JH
U1 = EPCS1SI8N_0
*#5 = TitleBlock0: Page Create Date: March  8, 1995

## Sheet PAGE06 FPGA Power.SchDoc
size 246 x 182 mm; SheetNumber: 6; SheetTotal: 9
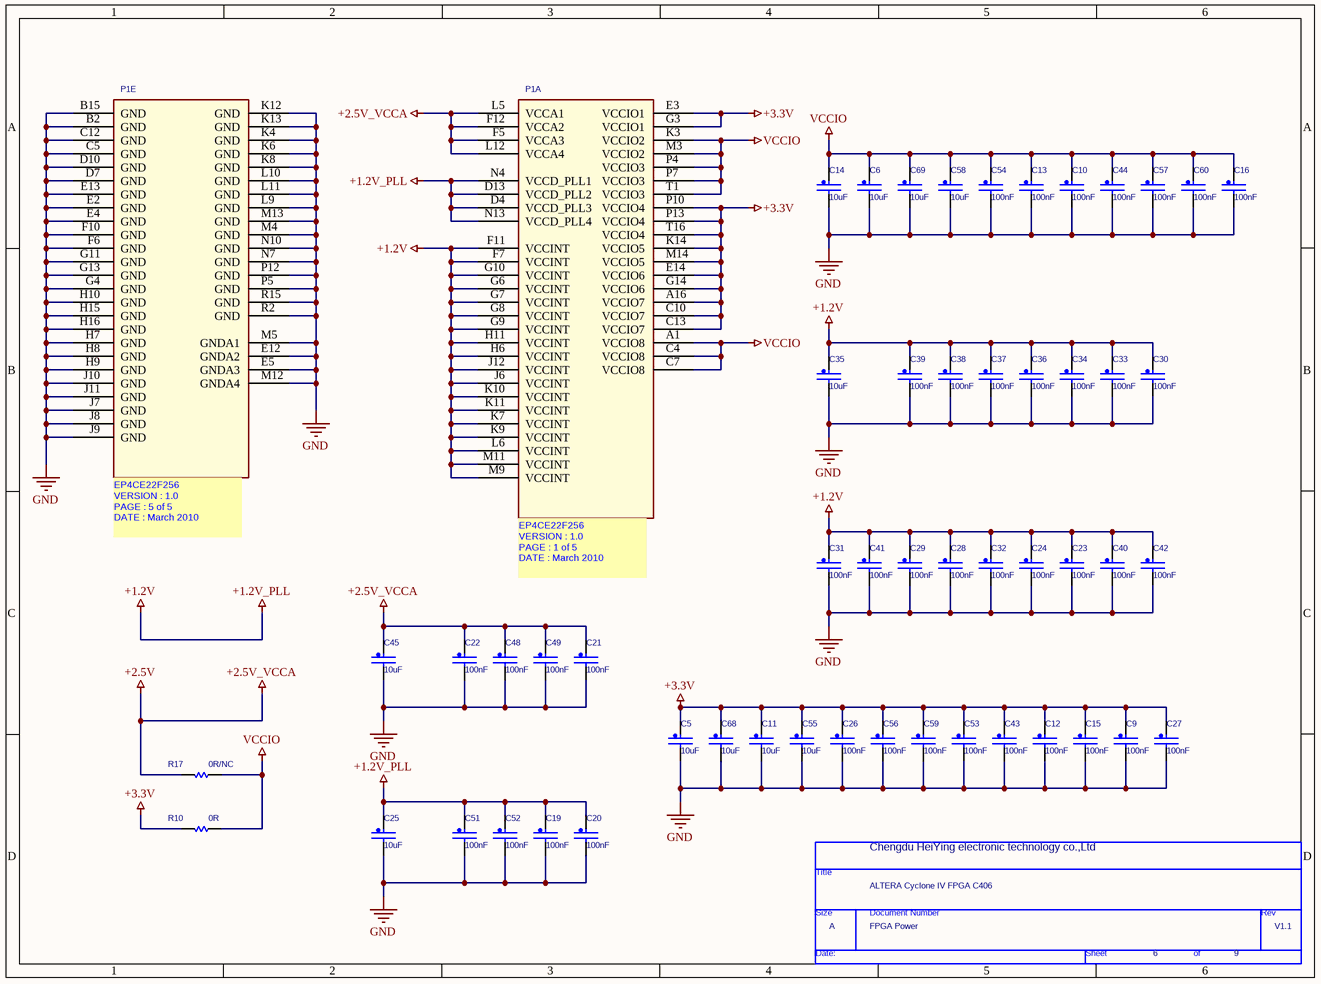
[diagram p5: PAGE06 FPGA Power.SchDoc]

### Parts
(Parts that share a designator on the sheet are numbered #1, #2 ... from top to bottom, then left to right.)
*#6  Page Count: 9  Page Number: 6  Page Size: A  Title: ALTERA Cyclone IV FPGA C406  RevCode: V1.1  Doc: FPGA Power  (hidden comment: TitleBlock0)  (graphical)
C5  10uF  [C0805]
C6  10uF  [C0805]
C9  100nF  [C0402]
C10  100nF  [C0402]
C11  10uF  [C0805]
C12  100nF  [C0402]
C13  100nF  [C0402]
C14  10uF  [C0805]
C15  100nF  [C0402]
C16  100nF  [C0402]
C19  100nF  [C0402]
C20  100nF  [C0402]
C21  100nF  [C0402]
C22  100nF  [C0402]
C23  100nF  [C0402]
C24  100nF  [C0402]
C25  10uF  [C0805]
C26  100nF  [C0402]
C27  100nF  [C0402]
C28  100nF  [C0402]
C29  100nF  [C0402]
C30  100nF  [C0402]
C31  100nF  [C0402]
C32  100nF  [C0402]
C33  100nF  [C0402]
C34  100nF  [C0402]
C35  10uF  [C0805]
C36  100nF  [C0402]
C37  100nF  [C0402]
C38  100nF  [C0402]
C39  100nF  [C0402]
C40  100nF  [C0402]
C41  100nF  [C0402]
C42  100nF  [C0402]
C43  100nF  [C0402]
C44  100nF  [C0402]
C45  10uF  [C0805]
C48  100nF  [C0402]
C49  100nF  [C0402]
C51  100nF  [C0402]
C52  100nF  [C0402]
C53  100nF  [C0402]
C54  100nF  [C0402]
C55  10uF  [C0805]
C56  100nF  [C0402]
C57  100nF  [C0402]
C58  10uF  [C0805]
C59  100nF  [C0402]
C60  100nF  [C0402]
C68  10uF  [C0805]
C69  10uF  [C0805]
P1  EP4CE22F256  [fbga256_opt1]  (value not drawn)  (parts A,E of 5)
R10  0R  [R0402]
R17  0R/NC  [R0402]

### Nets
+1.2V: C19.1 C20.1 C23.1 C24.1 C25.1 C28.1 C29.1 C30.1 C31.1 C32.1 C33.1 C34.1 C35.1 C36.1 C37.1 C38.1 C39.1 C40.1 C41.1 C42.1 C51.1 C52.1 P1.D4(VCCD_PLL3) P1.D13(VCCD_PLL2) P1.F7(VCCINT) P1.F11(VCCINT) P1.G6(VCCINT) P1.G7(VCCINT) P1.G8(VCCINT) P1.G9(VCCINT) P1.G10(VCCINT) P1.H6(VCCINT) P1.H11(VCCINT) P1.J6(VCCINT) P1.J12(VCCINT) P1.K7(VCCINT) P1.K9(VCCINT) P1.K10(VCCINT) P1.K11(VCCINT) P1.L6(VCCINT) P1.M9(VCCINT) P1.M11(VCCINT) P1.N4(VCCD_PLL1) P1.N13(VCCD_PLL4)  [also labelled +1.2V_PLL]
+2.5V: C21.1 C22.1 C45.1 C48.1 C49.1 P1.F5(VCCA3) P1.F12(VCCA2) P1.L5(VCCA1) P1.L12(VCCA4) R17.2  [also labelled +2.5V_VCCA]
+3.3V: C5.1 C9.1 C11.1 C12.1 C15.1 C26.1 C27.1 C43.1 C53.1 C55.1 C56.1 C59.1 C68.1 P1.A16(VCCIO7) P1.C10(VCCIO7) P1.C13(VCCIO7) P1.E3(VCCIO1) P1.E14(VCCIO6) P1.G3(VCCIO1) P1.G14(VCCIO6) P1.K14(VCCIO5) P1.M14(VCCIO5) P1.P10(VCCIO4) P1.P13(VCCIO4) P1.T16(VCCIO4) R10.2
GND: C5.2 C6.2 C9.2 C10.2 C11.2 C12.2 C13.2 C14.2 C15.2 C16.2 C19.2 C20.2 C21.2 C22.2 C23.2 C24.2 C25.2 C26.2 C27.2 C28.2 C29.2 C30.2 C31.2 C32.2 C33.2 C34.2 C35.2 C36.2 C37.2 C38.2 C39.2 C40.2 C41.2 C42.2 C43.2 C44.2 C45.2 C48.2 C49.2 C51.2 C52.2 C53.2 C54.2 C55.2 C56.2 C57.2 C58.2 C59.2 C60.2 C68.2 C69.2 P1.B2(GND) P1.B15(GND) P1.C5(GND) P1.C12(GND) P1.D7(GND) P1.D10(GND) P1.E2(GND) P1.E4(GND) P1.E5(GNDA3) P1.E12(GNDA2) P1.E13(GND) P1.F6(GND) P1.F10(GND) P1.G4(GND) P1.G11(GND) P1.G13(GND) P1.H7(GND) P1.H8(GND) P1.H9(GND) P1.H10(GND) P1.H15(GND) P1.H16(GND) P1.J7(GND) P1.J8(GND) P1.J9(GND) P1.J10(GND) P1.J11(GND) P1.K4(GND) P1.K6(GND) P1.K8(GND) P1.K12(GND) P1.K13(GND) P1.L9(GND) P1.L10(GND) P1.L11(GND) P1.M4(GND) P1.M5(GNDA1) P1.M12(GNDA4) P1.M13(GND) P1.N7(GND) P1.N10(GND) P1.P5(GND) P1.P12(GND) P1.R2(GND) P1.R15(GND)
VCCIO: C6.1 C10.1 C13.1 C14.1 C16.1 C44.1 C54.1 C57.1 C58.1 C60.1 C69.1 P1.A1(VCCIO8) P1.C4(VCCIO8) P1.C7(VCCIO8) P1.K3(VCCIO2) P1.M3(VCCIO2) P1.P4(VCCIO3) P1.P7(VCCIO3) P1.T1(VCCIO3) R10.1 R17.1

### Notes on the sheet
- Chengdu HeiYing electronic technology co.,Ltd
- (in symbol EP4CE22F256, part A) EP4CE22F256 / VERSION : 1.0 / PAGE : 1 of 5 / DATE : March 2010 /
- (in symbol EP4CE22F256, part E) EP4CE22F256 / VERSION : 1.0 / PAGE : 5 of 5 / DATE : March 2010 /
- (in symbol TitleBlock0) Title; Size; Document Number; Rev; Date:; Sheet; of

### Library data of the parts
C5 C11 C14 C25 C58 C69 = CAP_NP: Capacitor, 10u, 0805, X6S, 10%, 10V; AGILE_PN: 150-75429; MFG_NAME01: MURATA; MFG_PN01: GRM31CR71A106KA01L; CAD_APPROVED: Yes; FPLIST: CC0201,CC0201_HD,CC0201_3PIN,0201_CC; Tolerance: 10%; ROHS: Yes; HEIGHT: 0.33MM
C6 C35 C45 C55 C68 = CAP_NP: Capacitor, 10u, 0805, X6S, 10%, 10V; FPLIST: CC0201,CC0201_HD,CC0201_3PIN,0201_CC; CAD_APPROVED: Yes; MFG_PN01: GRM31CR71A106KA01L; MFG_NAME01: MURATA; AGILE_PN: 150-75429; HEIGHT: 0.33MM; ROHS: Yes; Tolerance: 10%
C9 C10 C13 C15 C16 C19 C21 C24 C28 C33 C36 C38 C40 C41 C44 C48 C51 C53 C56 = CAP_NP: CAP CER 0.1UF 6.3V 10% X5R 0201; AGILE_PN: 150-75429; MFG_NAME01: MURATA; MFG_PN01: GRM033R60J104KE19D; CAD_APPROVED: Yes; FPLIST: CC0201,CC0201_HD,CC0201_3PIN,0201_CC; Tolerance: 10%; ROHS: Yes; HEIGHT: 0.33MM
C12 C20 C22 C23 C26 C27 C29-C32 C34 C37 C39 C42 C43 C49 C52 C54 C57 C59 C60 = CAP_NP: CAP CER 0.1UF 6.3V 10% X5R 0201; FPLIST: CC0201,CC0201_HD,CC0201_3PIN,0201_CC; CAD_APPROVED: Yes; MFG_PN01: GRM033R60J104KE19D; MFG_NAME01: MURATA; AGILE_PN: 150-75429; HEIGHT: 0.33MM; ROHS: Yes; Tolerance: 10%
P1 = EP4CE22F256: as P1 on sheet PAGE03 FPGA IO
R10 R17 = SMALL R1
*#6 = TitleBlock0: Page Create Date: March  8, 1995

## Sheet PAGE07 SDRAM.SchDoc
size 246 x 182 mm; SheetNumber: 7; SheetTotal: 9
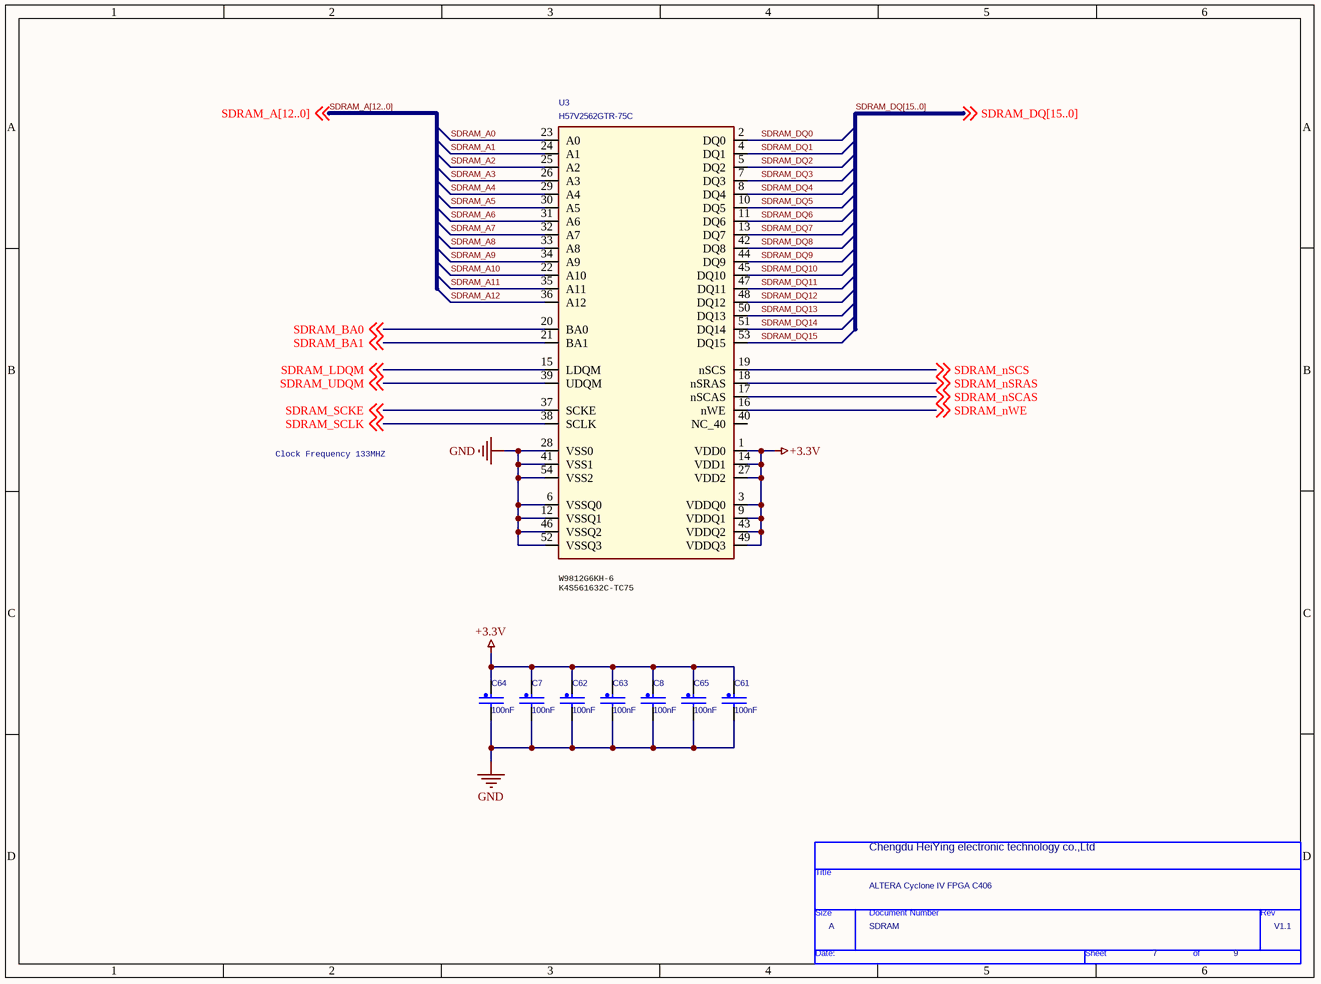
[diagram p6: PAGE07 SDRAM.SchDoc]

### Parts
(Parts that share a designator on the sheet are numbered #1, #2 ... from top to bottom, then left to right.)
*#7  Page Count: 9  Page Number: 7  Page Size: A  Title: ALTERA Cyclone IV FPGA C406  RevCode: V1.1  Doc: SDRAM  (hidden comment: TitleBlock0)  (graphical)
C7  100nF  [C0402]
C8  100nF  [C0402]
C61  100nF  [C0402]
C62  100nF  [C0402]
C63  100nF  [C0402]
C64  100nF  [C0402]
C65  100nF  [C0402]
U3  H57V2562GTR-75C  [TSOP54-400]

### Nets
+3.3V: C7.1 C8.1 C61.1 C62.1 C63.1 C64.1 C65.1 U3.1(VDD0) U3.3(VDDQ0) U3.9(VDDQ1) U3.14(VDD1) U3.27(VDD2) U3.43(VDDQ2) U3.49(VDDQ3)
GND: C7.2 C8.2 C61.2 C62.2 C63.2 C64.2 C65.2 U3.6(VSSQ0) U3.12(VSSQ1) U3.28(VSS0) U3.41(VSS1) U3.46(VSSQ2) U3.52(VSSQ3) U3.54(VSS2)
SDRAM_A0: U3.23(A0)
SDRAM_A1: U3.24(A1)
SDRAM_A2: U3.25(A2)
SDRAM_A3: U3.26(A3)
SDRAM_A4: U3.29(A4)
SDRAM_A5: U3.30(A5)
SDRAM_A6: U3.31(A6)
SDRAM_A7: U3.32(A7)
SDRAM_A8: U3.33(A8)
SDRAM_A9: U3.34(A9)
SDRAM_A10: U3.22(A10)
SDRAM_A11: U3.35(A11)
SDRAM_A12: U3.36(A12)
SDRAM_BA0: U3.20(BA0) ; off-sheet SDRAM_BA0
SDRAM_BA1: U3.21(BA1) ; off-sheet SDRAM_BA1
SDRAM_DQ0: U3.2(DQ0)
SDRAM_DQ1: U3.4(DQ1)
SDRAM_DQ2: U3.5(DQ2)
SDRAM_DQ3: U3.7(DQ3)
SDRAM_DQ4: U3.8(DQ4)
SDRAM_DQ5: U3.10(DQ5)
SDRAM_DQ6: U3.11(DQ6)
SDRAM_DQ7: U3.13(DQ7)
SDRAM_DQ8: U3.42(DQ8)
SDRAM_DQ9: U3.44(DQ9)
SDRAM_DQ10: U3.45(DQ10)
SDRAM_DQ11: U3.47(DQ11)
SDRAM_DQ12: U3.48(DQ12)
SDRAM_DQ13: U3.50(DQ13)
SDRAM_DQ14: U3.51(DQ14)
SDRAM_DQ15: U3.53(DQ15)
SDRAM_LDQM: U3.15(LDQM) ; off-sheet SDRAM_LDQM
SDRAM_nSCAS: U3.17(nSCAS) ; off-sheet SDRAM_nSCAS
SDRAM_nSCS: U3.19(nSCS) ; off-sheet SDRAM_nSCS
SDRAM_nSRAS: U3.18(nSRAS) ; off-sheet SDRAM_nSRAS
SDRAM_nWE: U3.16(nWE) ; off-sheet SDRAM_nWE
SDRAM_SCKE: U3.37(SCKE) ; off-sheet SDRAM_SCKE
SDRAM_SCLK: U3.38(SCLK) ; off-sheet SDRAM_SCLK
SDRAM_UDQM: U3.39(UDQM) ; off-sheet SDRAM_UDQM

Not connected (* = marked no-connect by the designer): U3 40(NC_40)

### Buses and harness runs
bus SDRAM_A[12..0]
bus SDRAM_DQ[15..0]

### Notes on the sheet
- Clock Frequency 133MHZ
- (near U3) W9812G6KH-6
  K4S561632C-TC75
- Chengdu HeiYing electronic technology co.,Ltd
- (in symbol TitleBlock0) Title; Size; Document Number; Rev; Date:; Sheet; of

### Library data of the parts
C7 C63 C65 = CAP_NP: as C12 on sheet PAGE06 FPGA Power; HEIGHT: 0.33MM; ROHS: Yes; Tolerance: 10%
C8 C61 C62 C64 = CAP_NP: as C9 on sheet PAGE06 FPGA Power; Tolerance: 10%; ROHS: Yes; HEIGHT: 0.33MM
U3 = K4S561632C-TC75_0
*#7 = TitleBlock0: Page Create Date: March  8, 1995

## Sheet PAGE08 System Power.SchDoc
size 297 x 209 mm; SheetNumber: 8; SheetTotal: 9
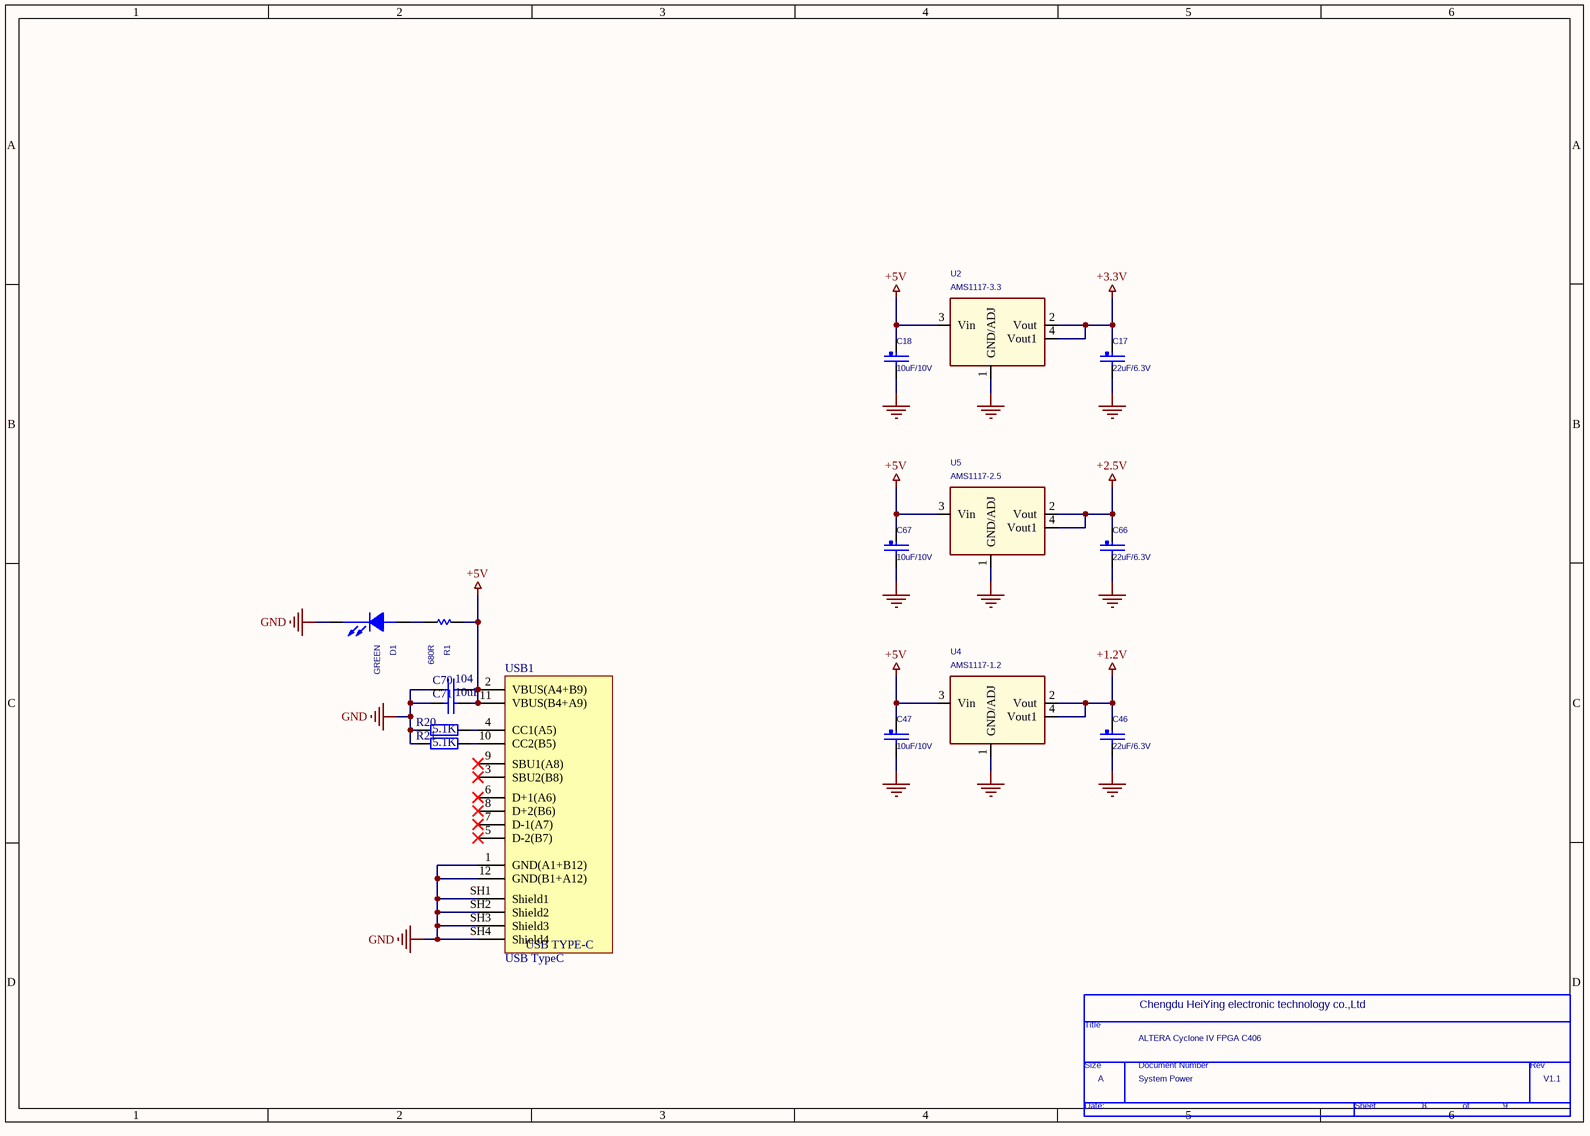
[diagram p7: PAGE08 System Power.SchDoc]

### Parts
(Parts that share a designator on the sheet are numbered #1, #2 ... from top to bottom, then left to right.)
*#8  Page Count: 9  Page Number: 8  Page Size: A  Title: ALTERA Cyclone IV FPGA C406  RevCode: V1.1  Doc: System Power  (hidden comment: TitleBlock0)  (graphical)
C17  22uF/6.3V  [C0805]
C18  10uF/10V  [C0805]
C46  22uF/6.3V  [C0805]
C47  10uF/10V  [C0805]
C66  22uF/6.3V  [C0805]
C67  10uF/10V  [C0805]
C70  104  [C 0603]
C71  10uF  [C 0603]
D1  GREEN  [Q0603]
R1  680R  [R 0603]
R20  5.1K  [R 0603]
R21  5.1K  [R 0603]
U2  AMS1117-3.3  [SOT-223]
U4  AMS1117-1.2  [SOT-223]
U5  AMS1117-2.5  [SOT-223]
USB1  USB TypeC  [USB2.0-TYPE-C-16P]

### Nets
+1.2V: C46.1 U4.2(Vout) U4.4(Vout1)
+2.5V: C66.1 U5.2(Vout) U5.4(Vout1)
+3.3V: C17.1 U2.2(Vout) U2.4(Vout1)
+5V: C18.1 C47.1 C67.1 C70.1 C71.1 R1.1 U2.3(Vin) U4.3(Vin) U5.3(Vin) USB1.2(VBUS(A4+B9)) USB1.11(VBUS(B4+A9))
GND: C17.2 C18.2 C46.2 C47.2 C66.2 C67.2 C70.2 C71.2 D1.2(CATHODE) R20.2 R21.2 U2.1(GND/ADJ) U4.1(GND/ADJ) U5.1(GND/ADJ) USB1.1(GND(A1+B12)) USB1.12(GND(B1+A12)) USB1.SH1(Shield1) USB1.SH2(Shield2) USB1.SH3(Shield3) USB1.SH4(Shield4)
NetD1_1: D1.1(ANODE) R1.2
NetR20_1: R20.1 USB1.4(CC1(A5))
NetR21_1: R21.1 USB1.10(CC2(B5))

Not connected (* = marked no-connect by the designer): USB1 3(SBU2(B8))* 5(D-2(B7))* 6(D+1(A6))* 7(D-1(A7))* 8(D+2(B6))* 9(SBU1(A8))*

### Notes on the sheet
- Chengdu HeiYing electronic technology co.,Ltd
- (in symbol TitleBlock0) Title; Size; Document Number; Rev; Date:; Sheet; of
- (in symbol USB Type-C) USB TYPE-C

### Library data of the parts
C17 C46 = CAP_NP: as C6 on sheet PAGE06 FPGA Power; HEIGHT: 0.33MM; ROHS: Yes; Tolerance: 10%
C18 C47 = CAP_NP: CAP CER 22UF 16V 10%; AGILE_PN: 150-75429; MFG_NAME01: Murata; MFG_PN01: GRM033R60J104KE19D; CAD_APPROVED: Yes; FPLIST: CC0201,CC0201_HD,CC0201_3PIN,0201_CC; Tolerance: 10%; ROHS: Yes; HEIGHT: 0.33MM
C66 = CAP_NP: as C5 on sheet PAGE06 FPGA Power; Tolerance: 10%; ROHS: Yes; HEIGHT: 0.33MM
C67 = CAP_NP: CAP CER 22UF 16V 10%; FPLIST: CC0201,CC0201_HD,CC0201_3PIN,0201_CC; CAD_APPROVED: Yes; MFG_PN01: GRM033R60J104KE19D; MFG_NAME01: Murata; AGILE_PN: 150-75429; HEIGHT: 0.33MM; ROHS: Yes; Tolerance: 10%
C70 C71 = C-0603-SMD
D1 = LED: ROOM: POWER
R1 = SMALL R1
R20 R21 = R: 电阻; BOM名称: 贴片电阻; 版权归属: 正点原子; 学习资源: www.openedv.com; Parameter: 电阻
U2 U4 U5 = AMS1117
USB1 = USB Type-C: 12P TypeC 母座
*#8 = TitleBlock0: Page Create Date: March  8, 1995

## Sheet PAGE09 Connectors.SchDoc
size 420 x 297 mm; SheetNumber: 9; SheetTotal: 9
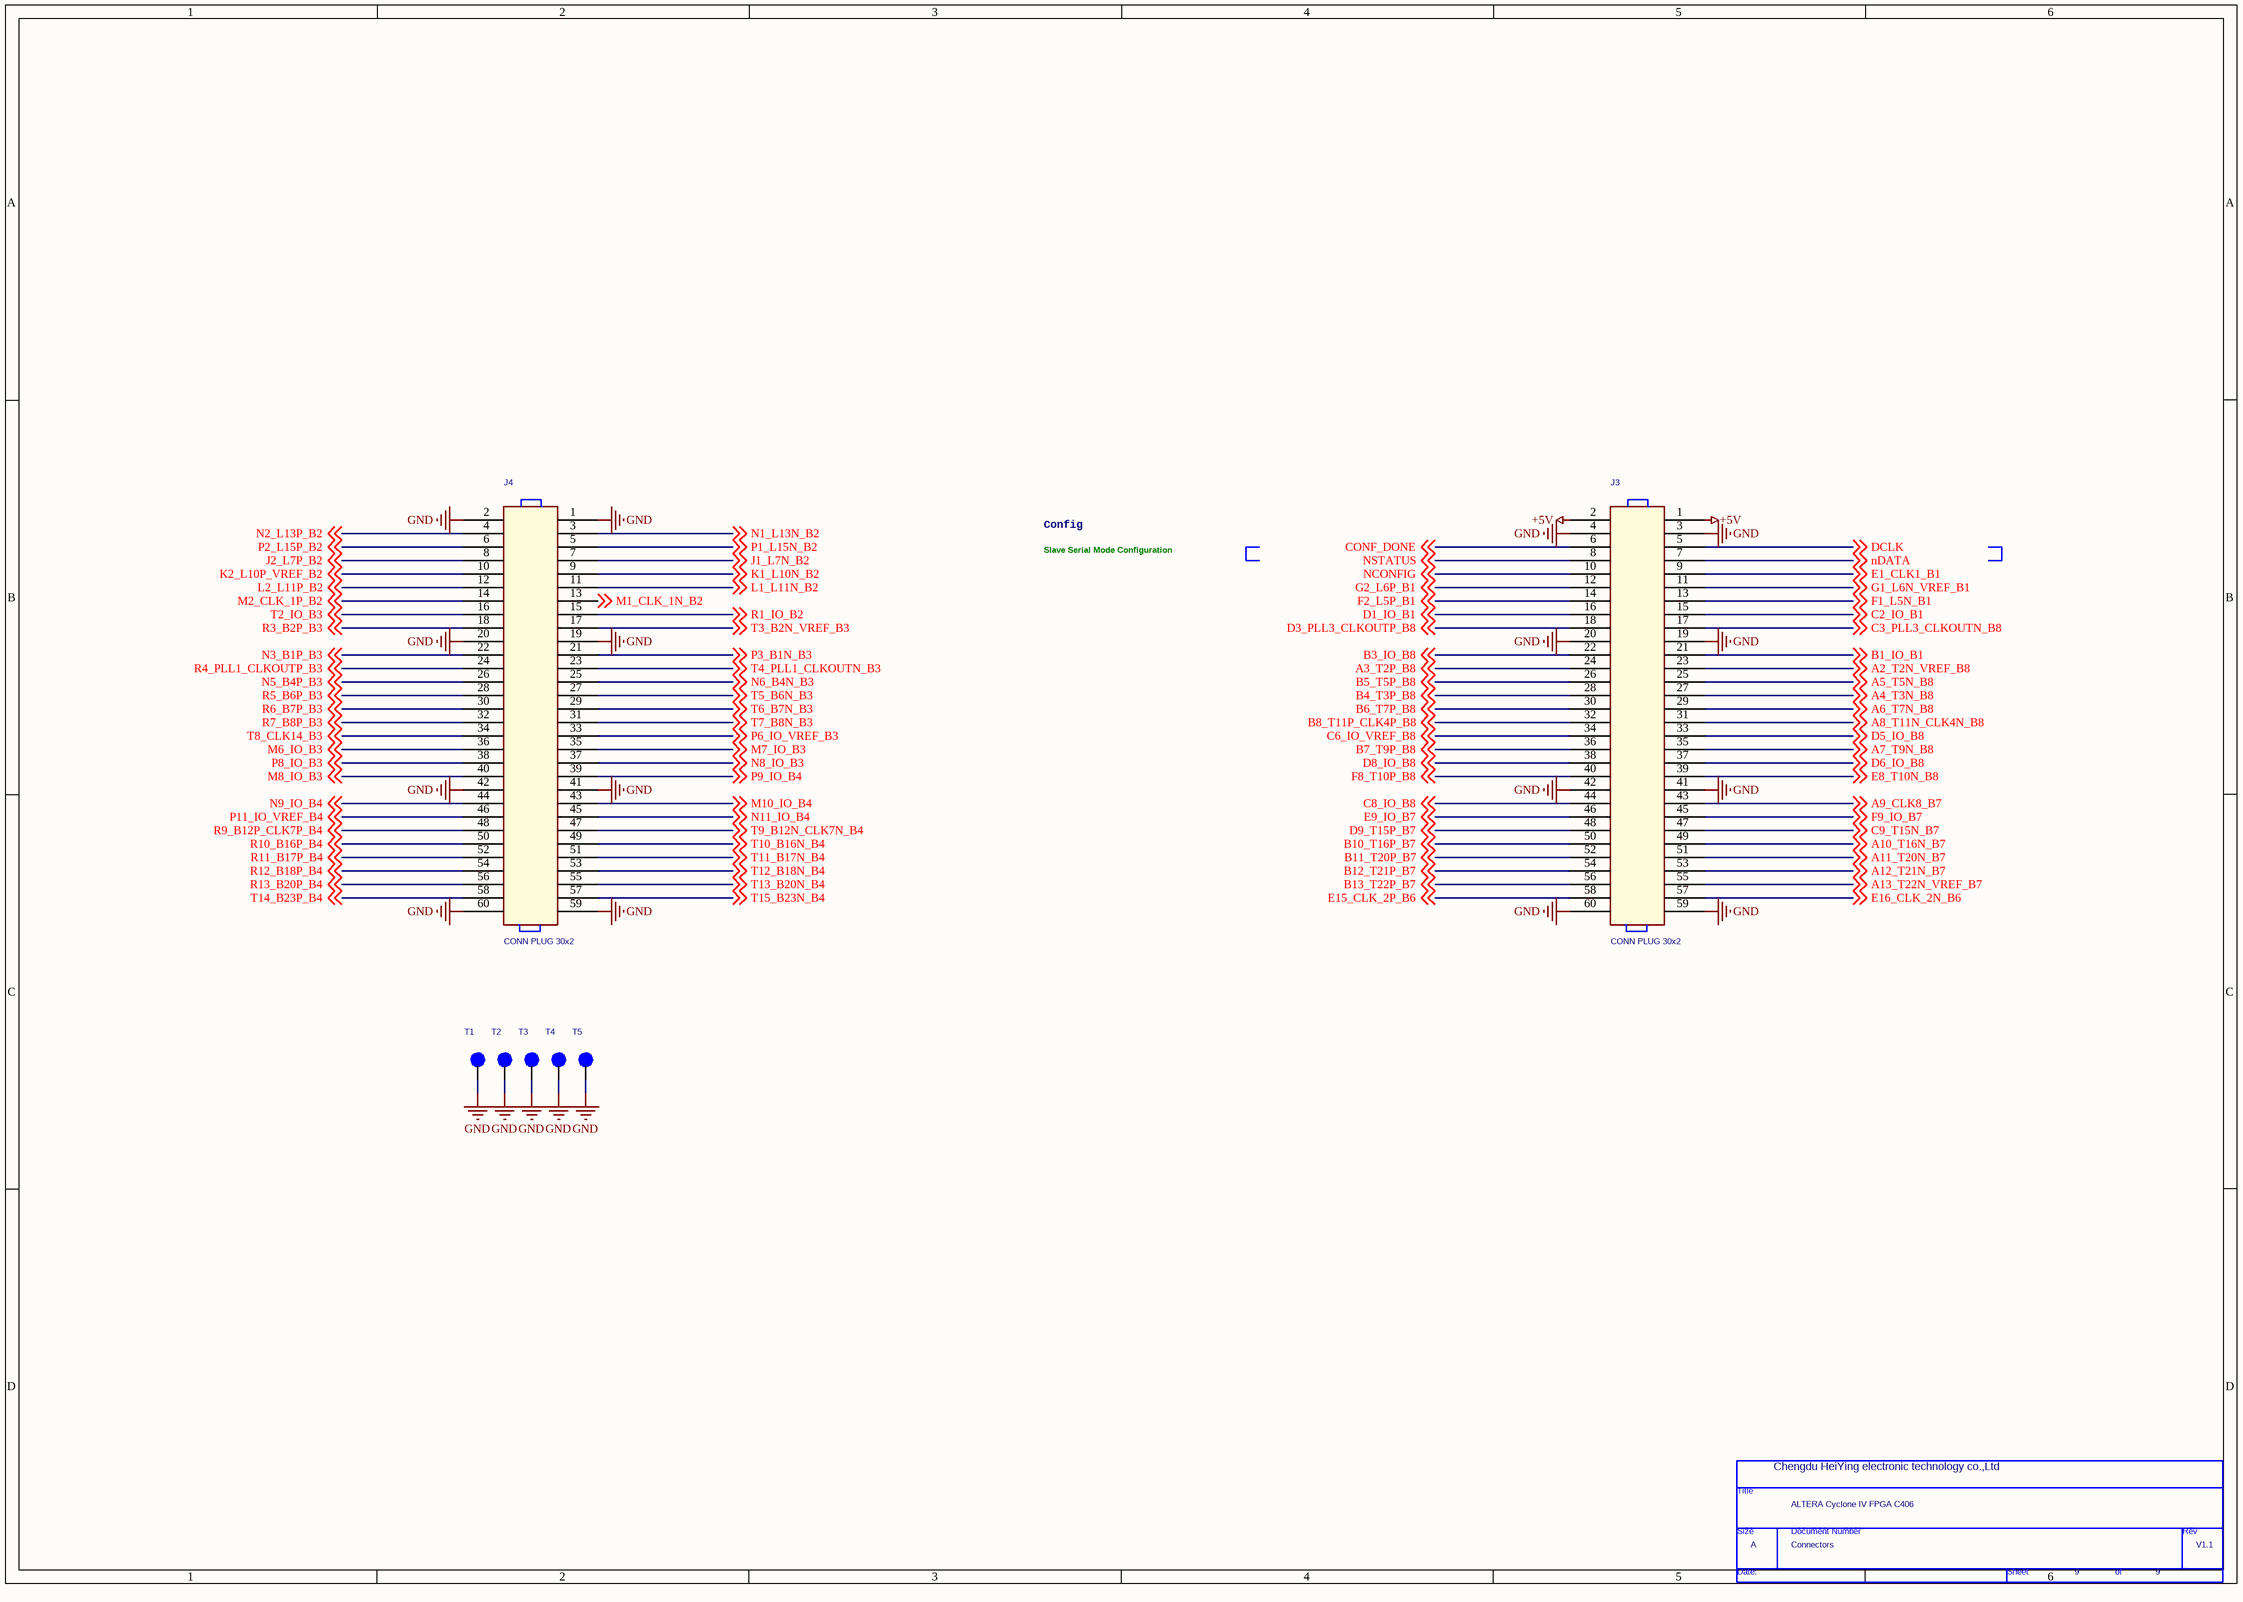
[diagram p8: PAGE09 Connectors.SchDoc]

### Parts
(Parts that share a designator on the sheet are numbered #1, #2 ... from top to bottom, then left to right.)
*#9  Page Count: 9  Page Size: A  Title: ALTERA Cyclone IV FPGA C406  RevCode: V1.1  Doc: Connectors  (hidden comment: TitleBlock0)  (graphical)
J3  CONN PLUG 30x2  [DIP2X30_2P54]
J4  CONN PLUG 30x2  [DIP2X30_2P54]
T1  TPAD_015  [TP_OBL1_4X0_6]  (value not drawn)
T2  TPAD_015  [TP_OBL1_4X0_6]  (value not drawn)
T3  TPAD_015  [TP_OBL1_4X0_6]  (value not drawn)
T4  TPAD_015  [TP_OBL1_4X0_6]  (value not drawn)
T5  TPAD_015  [TP_OBL1_4X0_6]  (value not drawn)

### Nets
+5V: J3.1 J3.2
GND: J3.3 J3.4 J3.19 J3.20 J3.41 J3.42 J3.59 J3.60 J4.1 J4.2 J4.19 J4.20 J4.41 J4.42 J4.59 J4.60 T1.1(Pin1) T2.1(Pin1) T3.1(Pin1) T4.1(Pin1) T5.1(Pin1)
A2_T2N_VREF_B8: J3.23 ; off-sheet A2_T2N_VREF_B8
A3_T2P_B8: J3.24 ; off-sheet A3_T2P_B8
A4_T3N_B8: J3.27 ; off-sheet A4_T3N_B8
A5_T5N_B8: J3.25 ; off-sheet A5_T5N_B8
A6_T7N_B8: J3.29 ; off-sheet A6_T7N_B8
A7_T9N_B8: J3.35 ; off-sheet A7_T9N_B8
A8_T11N_CLK4N_B8: J3.31 ; off-sheet A8_T11N_CLK4N_B8
A9_CLK8_B7: J3.43 ; off-sheet A9_CLK8_B7
A10_T16N_B7: J3.49 ; off-sheet A10_T16N_B7
A11_T20N_B7: J3.51 ; off-sheet A11_T20N_B7
A12_T21N_B7: J3.53 ; off-sheet A12_T21N_B7
A13_T22N_VREF_B7: J3.55 ; off-sheet A13_T22N_VREF_B7
B1_IO_B1: J3.21 ; off-sheet B1_IO_B1
B3_IO_B8: J3.22 ; off-sheet B3_IO_B8
B4_T3P_B8: J3.28 ; off-sheet B4_T3P_B8
B5_T5P_B8: J3.26 ; off-sheet B5_T5P_B8
B6_T7P_B8: J3.30 ; off-sheet B6_T7P_B8
B7_T9P_B8: J3.36 ; off-sheet B7_T9P_B8
B8_T11P_CLK4P_B8: J3.32 ; off-sheet B8_T11P_CLK4P_B8
B10_T16P_B7: J3.50 ; off-sheet B10_T16P_B7
B11_T20P_B7: J3.52 ; off-sheet B11_T20P_B7
B12_T21P_B7: J3.54 ; off-sheet B12_T21P_B7
B13_T22P_B7: J3.56 ; off-sheet B13_T22P_B7
C2_IO_B1: J3.15 ; off-sheet C2_IO_B1
C3_PLL3_CLKOUTN_B8: J3.17 ; off-sheet C3_PLL3_CLKOUTN_B8
C6_IO_VREF_B8: J3.34 ; off-sheet C6_IO_VREF_B8
C8_IO_B8: J3.44 ; off-sheet C8_IO_B8
C9_T15N_B7: J3.47 ; off-sheet C9_T15N_B7
CONF_DONE: J3.6 ; off-sheet CONF_DONE
D1_IO_B1: J3.16 ; off-sheet D1_IO_B1
D3_PLL3_CLKOUTP_B8: J3.18 ; off-sheet D3_PLL3_CLKOUTP_B8
D5_IO_B8: J3.33 ; off-sheet D5_IO_B8
D6_IO_B8: J3.37 ; off-sheet D6_IO_B8
D8_IO_B8: J3.38 ; off-sheet D8_IO_B8
D9_T15P_B7: J3.48 ; off-sheet D9_T15P_B7
DCLK: J3.5 ; off-sheet DCLK
E1_CLK1_B1: J3.9 ; off-sheet E1_CLK1_B1
E8_T10N_B8: J3.39 ; off-sheet E8_T10N_B8
E9_IO_B7: J3.46 ; off-sheet E9_IO_B7
E15_CLK_2P_B6: J3.58 ; off-sheet E15_CLK_2P_B6
E16_CLK_2N_B6: J3.57 ; off-sheet E16_CLK_2N_B6
F1_L5N_B1: J3.13 ; off-sheet F1_L5N_B1
F2_L5P_B1: J3.14 ; off-sheet F2_L5P_B1
F8_T10P_B8: J3.40 ; off-sheet F8_T10P_B8
F9_IO_B7: J3.45 ; off-sheet F9_IO_B7
G1_L6N_VREF_B1: J3.11 ; off-sheet G1_L6N_VREF_B1
G2_L6P_B1: J3.12 ; off-sheet G2_L6P_B1
J1_L7N_B2: J4.7 ; off-sheet J1_L7N_B2
J2_L7P_B2: J4.8 ; off-sheet J2_L7P_B2
K1_L10N_B2: J4.9 ; off-sheet K1_L10N_B2
K2_L10P_VREF_B2: J4.10 ; off-sheet K2_L10P_VREF_B2
L1_L11N_B2: J4.11 ; off-sheet L1_L11N_B2
L2_L11P_B2: J4.12 ; off-sheet L2_L11P_B2
M1_CLK_1N_B2: J4.13 ; off-sheet M1_CLK_1N_B2
M2_CLK_1P_B2: J4.14 ; off-sheet M2_CLK_1P_B2
M6_IO_B3: J4.36 ; off-sheet M6_IO_B3
M7_IO_B3: J4.35 ; off-sheet M7_IO_B3
M8_IO_B3: J4.40 ; off-sheet M8_IO_B3
M10_IO_B4: J4.43 ; off-sheet M10_IO_B4
N1_L13N_B2: J4.3 ; off-sheet N1_L13N_B2
N2_L13P_B2: J4.4 ; off-sheet N2_L13P_B2
N3_B1P_B3: J4.22 ; off-sheet N3_B1P_B3
N5_B4P_B3: J4.26 ; off-sheet N5_B4P_B3
N6_B4N_B3: J4.25 ; off-sheet N6_B4N_B3
N8_IO_B3: J4.37 ; off-sheet N8_IO_B3
N9_IO_B4: J4.44 ; off-sheet N9_IO_B4
N11_IO_B4: J4.45 ; off-sheet N11_IO_B4
NCONFIG: J3.10 ; off-sheet NCONFIG
nDATA: J3.7 ; off-sheet nDATA
NSTATUS: J3.8 ; off-sheet NSTATUS
P1_L15N_B2: J4.5 ; off-sheet P1_L15N_B2
P2_L15P_B2: J4.6 ; off-sheet P2_L15P_B2
P3_B1N_B3: J4.21 ; off-sheet P3_B1N_B3
P6_IO_VREF_B3: J4.33 ; off-sheet P6_IO_VREF_B3
P8_IO_B3: J4.38 ; off-sheet P8_IO_B3
P9_IO_B4: J4.39 ; off-sheet P9_IO_B4
P11_IO_VREF_B4: J4.46 ; off-sheet P11_IO_VREF_B4
R1_IO_B2: J4.15 ; off-sheet R1_IO_B2
R3_B2P_B3: J4.18 ; off-sheet R3_B2P_B3
R4_PLL1_CLKOUTP_B3: J4.24 ; off-sheet R4_PLL1_CLKOUTP_B3
R5_B6P_B3: J4.28 ; off-sheet R5_B6P_B3
R6_B7P_B3: J4.30 ; off-sheet R6_B7P_B3
R7_B8P_B3: J4.32 ; off-sheet R7_B8P_B3
R9_B12P_CLK7P_B4: J4.48 ; off-sheet R9_B12P_CLK7P_B4
R10_B16P_B4: J4.50 ; off-sheet R10_B16P_B4
R11_B17P_B4: J4.52 ; off-sheet R11_B17P_B4
R12_B18P_B4: J4.54 ; off-sheet R12_B18P_B4
R13_B20P_B4: J4.56 ; off-sheet R13_B20P_B4
T2_IO_B3: J4.16 ; off-sheet T2_IO_B3
T3_B2N_VREF_B3: J4.17 ; off-sheet T3_B2N_VREF_B3
T4_PLL1_CLKOUTN_B3: J4.23 ; off-sheet T4_PLL1_CLKOUTN_B3
T5_B6N_B3: J4.27 ; off-sheet T5_B6N_B3
T6_B7N_B3: J4.29 ; off-sheet T6_B7N_B3
T7_B8N_B3: J4.31 ; off-sheet T7_B8N_B3
T8_CLK14_B3: J4.34 ; off-sheet T8_CLK14_B3
T9_B12N_CLK7N_B4: J4.47 ; off-sheet T9_B12N_CLK7N_B4
T10_B16N_B4: J4.49 ; off-sheet T10_B16N_B4
T11_B17N_B4: J4.51 ; off-sheet T11_B17N_B4
T12_B18N_B4: J4.53 ; off-sheet T12_B18N_B4
T13_B20N_B4: J4.55 ; off-sheet T13_B20N_B4
T14_B23P_B4: J4.58 ; off-sheet T14_B23P_B4
T15_B23N_B4: J4.57 ; off-sheet T15_B23N_B4

### Notes on the sheet
- Config
- Slave Serial Mode Configuration
- (near *#9) Chengdu HeiYing electronic technology co.,Ltd
- (in symbol TitleBlock0) Title; Size; Document Number; Rev; Date:; Sheet; of

### Library data of the parts
T1 T2 T4 = TESTLOOP: TEST POINT PAD 15MIL DIA SMT, NO PART TO ORDER; CLASS: IO; CAD_APPROVED: Yes; ASSY_OPT: DNP; MFG_PN01: NOTACOMPONENT; AGILE_PN: 211-76645; HEIGHT: 0.1MM; ROHS: Yes; MFG_NAME01: NOTACOMPONENT
T3 T5 = TESTLOOP: TEST POINT PAD 15MIL DIA SMT, NO PART TO ORDER; CLASS: IO; AGILE_PN: 211-76645; MFG_NAME01: NOTACOMPONENT; ASSY_OPT: DNP; CAD_APPROVED: Yes; MFG_PN01: NOTACOMPONENT; ROHS: Yes; HEIGHT: 0.1MM
*#9 = TitleBlock0: Page Number: 9; Page Create Date: March  8, 1995

## Nets that join several sheets
+1.2V: PAGE06 FPGA Power (44 pins), PAGE08 System Power (C46.1 U4.2 U4.4)
+2.5V: PAGE05 FPGA Config (6 pins), PAGE06 FPGA Power (10 pins), PAGE08 System Power (C66.1 U5.2 U5.4)
+3.3V: PAGE03 FPGA IO (R8.2 R9.2 R13.2), PAGE04 FPGA CLOCK (C1.1 C2.1 Y1.4 Y2.4), PAGE05 FPGA Config (6 pins), PAGE06 FPGA Power (26 pins), PAGE07 SDRAM (14 pins), PAGE08 System Power (C17.1 U2.2 U2.4)
+5V: PAGE08 System Power (11 pins), PAGE09 Connectors (J3.1 J3.2)
GND: PAGE03 FPGA IO (P1.J3), PAGE04 FPGA CLOCK (C1.2 C2.2 Y1.2 Y2.2), PAGE05 FPGA Config (11 pins), PAGE06 FPGA Power (96 pins), PAGE07 SDRAM (14 pins), PAGE08 System Power (20 pins), PAGE09 Connectors (21 pins)
A2_T2N_VREF_B8: PAGE03 FPGA IO (P1.A2), PAGE09 Connectors (J3.23)
A3_T2P_B8: PAGE03 FPGA IO (P1.A3), PAGE09 Connectors (J3.24)
A4_T3N_B8: PAGE03 FPGA IO (P1.A4), PAGE09 Connectors (J3.27)
A5_T5N_B8: PAGE03 FPGA IO (P1.A5), PAGE09 Connectors (J3.25)
A6_T7N_B8: PAGE03 FPGA IO (P1.A6), PAGE09 Connectors (J3.29)
A7_T9N_B8: PAGE03 FPGA IO (P1.A7), PAGE09 Connectors (J3.35)
A8_T11N_CLK4N_B8: PAGE04 FPGA CLOCK (P1.A8), PAGE09 Connectors (J3.31)
A9_CLK8_B7: PAGE04 FPGA CLOCK (P1.A9), PAGE09 Connectors (J3.43)
A10_T16N_B7: PAGE03 FPGA IO (P1.A10), PAGE09 Connectors (J3.49)
A11_T20N_B7: PAGE03 FPGA IO (P1.A11), PAGE09 Connectors (J3.51)
A12_T21N_B7: PAGE03 FPGA IO (P1.A12), PAGE09 Connectors (J3.53)
A13_T22N_VREF_B7: PAGE03 FPGA IO (P1.A13), PAGE09 Connectors (J3.55)
ASDO: PAGE03 FPGA IO (P1.C1), PAGE05 FPGA Config (U1.5)
B1_IO_B1: PAGE03 FPGA IO (P1.B1), PAGE09 Connectors (J3.21)
B3_IO_B8: PAGE03 FPGA IO (P1.B3), PAGE09 Connectors (J3.22)
B4_T3P_B8: PAGE03 FPGA IO (P1.B4), PAGE09 Connectors (J3.28)
B5_T5P_B8: PAGE03 FPGA IO (P1.B5), PAGE09 Connectors (J3.26)
B6_T7P_B8: PAGE03 FPGA IO (P1.B6), PAGE09 Connectors (J3.30)
B7_T9P_B8: PAGE03 FPGA IO (P1.B7), PAGE09 Connectors (J3.36)
B8_T11P_CLK4P_B8: PAGE04 FPGA CLOCK (P1.B8), PAGE09 Connectors (J3.32)
B10_T16P_B7: PAGE03 FPGA IO (P1.B10), PAGE09 Connectors (J3.50)
B11_T20P_B7: PAGE03 FPGA IO (P1.B11), PAGE09 Connectors (J3.52)
B12_T21P_B7: PAGE03 FPGA IO (P1.B12), PAGE09 Connectors (J3.54)
B13_T22P_B7: PAGE03 FPGA IO (P1.B13), PAGE09 Connectors (J3.56)
C2_IO_B1: PAGE03 FPGA IO (P1.C2), PAGE09 Connectors (J3.15)
C3_PLL3_CLKOUTN_B8: PAGE03 FPGA IO (P1.C3), PAGE09 Connectors (J3.17)
C6_IO_VREF_B8: PAGE04 FPGA CLOCK (P1.C6), PAGE09 Connectors (J3.34)
C8_IO_B8: PAGE03 FPGA IO (P1.C8), PAGE09 Connectors (J3.44)
C9_T15N_B7: PAGE03 FPGA IO (P1.C9), PAGE09 Connectors (J3.47)
CONF_DONE: PAGE03 FPGA IO (P1.H14 R13.1), PAGE09 Connectors (J3.6)
D1_IO_B1: PAGE03 FPGA IO (P1.D1), PAGE09 Connectors (J3.16)
D3_PLL3_CLKOUTP_B8: PAGE03 FPGA IO (P1.D3), PAGE09 Connectors (J3.18)
D5_IO_B8: PAGE03 FPGA IO (P1.D5), PAGE09 Connectors (J3.33)
D6_IO_B8: PAGE03 FPGA IO (P1.D6), PAGE09 Connectors (J3.37)
D8_IO_B8: PAGE03 FPGA IO (P1.D8), PAGE09 Connectors (J3.38)
D9_T15P_B7: PAGE03 FPGA IO (P1.D9), PAGE09 Connectors (J3.48)
DCLK: PAGE03 FPGA IO (P1.H1), PAGE05 FPGA Config (R7.2), PAGE09 Connectors (J3.5)
E1_CLK1_B1: PAGE04 FPGA CLOCK (P1.E1), PAGE09 Connectors (J3.9)
E8_T10N_B8: PAGE03 FPGA IO (P1.E8), PAGE09 Connectors (J3.39)
E9_IO_B7: PAGE03 FPGA IO (P1.E9), PAGE09 Connectors (J3.46)
E10_LED0_B7: PAGE03 FPGA IO (P1.E10), PAGE05 FPGA Config (R2.2)
E15_CLK_2P_B6: PAGE04 FPGA CLOCK (P1.E15), PAGE09 Connectors (J3.58)
E16_CLK_2N_B6: PAGE04 FPGA CLOCK (P1.E16), PAGE09 Connectors (J3.57)
F1_L5N_B1: PAGE03 FPGA IO (P1.F1), PAGE09 Connectors (J3.13)
F2_L5P_B1: PAGE03 FPGA IO (P1.F2), PAGE09 Connectors (J3.14)
F8_T10P_B8: PAGE03 FPGA IO (P1.F8), PAGE09 Connectors (J3.40)
F9_IO_B7: PAGE03 FPGA IO (P1.F9), PAGE09 Connectors (J3.45)
G1_L6N_VREF_B1: PAGE03 FPGA IO (P1.G1), PAGE09 Connectors (J3.11)
G2_L6P_B1: PAGE03 FPGA IO (P1.G2), PAGE09 Connectors (J3.12)
J1_L7N_B2: PAGE03 FPGA IO (P1.J1), PAGE09 Connectors (J4.7)
J2_L7P_B2: PAGE03 FPGA IO (P1.J2), PAGE09 Connectors (J4.8)
K1_L10N_B2: PAGE03 FPGA IO (P1.K1), PAGE09 Connectors (J4.9)
K2_L10P_VREF_B2: PAGE03 FPGA IO (P1.K2), PAGE09 Connectors (J4.10)
L1_L11N_B2: PAGE03 FPGA IO (P1.L1), PAGE09 Connectors (J4.11)
L2_L11P_B2: PAGE03 FPGA IO (P1.L2), PAGE09 Connectors (J4.12)
M1_CLK_1N_B2: PAGE04 FPGA CLOCK (P1.M1), PAGE09 Connectors (J4.13)
M2_CLK_1P_B2: PAGE04 FPGA CLOCK (P1.M2), PAGE09 Connectors (J4.14)
M6_IO_B3: PAGE03 FPGA IO (P1.M6), PAGE09 Connectors (J4.36)
M7_IO_B3: PAGE03 FPGA IO (P1.M7), PAGE09 Connectors (J4.35)
M8_IO_B3: PAGE03 FPGA IO (P1.M8), PAGE09 Connectors (J4.40)
M10_IO_B4: PAGE03 FPGA IO (P1.M10), PAGE09 Connectors (J4.43)
MSEL0: PAGE03 FPGA IO (P1.H13), PAGE05 FPGA Config (R12.2 R15.1)
MSEL1: PAGE03 FPGA IO (P1.H12), PAGE05 FPGA Config (R11.2)
MSEL2: PAGE03 FPGA IO (P1.G12), PAGE05 FPGA Config (R14.1)
N1_L13N_B2: PAGE03 FPGA IO (P1.N1), PAGE09 Connectors (J4.3)
N2_L13P_B2: PAGE03 FPGA IO (P1.N2), PAGE09 Connectors (J4.4)
N3_B1P_B3: PAGE03 FPGA IO (P1.N3), PAGE09 Connectors (J4.22)
N5_B4P_B3: PAGE03 FPGA IO (P1.N5), PAGE09 Connectors (J4.26)
N6_B4N_B3: PAGE03 FPGA IO (P1.N6), PAGE09 Connectors (J4.25)
N8_IO_B3: PAGE03 FPGA IO (P1.N8), PAGE09 Connectors (J4.37)
N9_IO_B4: PAGE03 FPGA IO (P1.N9), PAGE09 Connectors (J4.44)
N11_IO_B4: PAGE03 FPGA IO (P1.N11), PAGE09 Connectors (J4.45)
NCONFIG: PAGE03 FPGA IO (P1.H5 R8.1), PAGE09 Connectors (J3.10)
nCSO: PAGE03 FPGA IO (P1.D2), PAGE05 FPGA Config (U1.1)
nDATA: PAGE03 FPGA IO (P1.H2), PAGE05 FPGA Config (R6.1), PAGE09 Connectors (J3.7)
NSTATUS: PAGE03 FPGA IO (P1.F4 R9.1), PAGE09 Connectors (J3.8)
P1_L15N_B2: PAGE03 FPGA IO (P1.P1), PAGE09 Connectors (J4.5)
P2_L15P_B2: PAGE03 FPGA IO (P1.P2), PAGE09 Connectors (J4.6)
P3_B1N_B3: PAGE03 FPGA IO (P1.P3), PAGE09 Connectors (J4.21)
P6_IO_VREF_B3: PAGE04 FPGA CLOCK (P1.P6), PAGE09 Connectors (J4.33)
P8_IO_B3: PAGE03 FPGA IO (P1.P8), PAGE09 Connectors (J4.38)
P9_IO_B4: PAGE03 FPGA IO (P1.P9), PAGE09 Connectors (J4.39)
P11_IO_VREF_B4: PAGE04 FPGA CLOCK (P1.P11), PAGE09 Connectors (J4.46)
R1_IO_B2: PAGE03 FPGA IO (P1.R1), PAGE09 Connectors (J4.15)
R3_B2P_B3: PAGE03 FPGA IO (P1.R3), PAGE09 Connectors (J4.18)
R4_PLL1_CLKOUTP_B3: PAGE03 FPGA IO (P1.R4), PAGE09 Connectors (J4.24)
R5_B6P_B3: PAGE03 FPGA IO (P1.R5), PAGE09 Connectors (J4.28)
R6_B7P_B3: PAGE03 FPGA IO (P1.R6), PAGE09 Connectors (J4.30)
R7_B8P_B3: PAGE03 FPGA IO (P1.R7), PAGE09 Connectors (J4.32)
R8_KEY_B3: PAGE04 FPGA CLOCK (P1.R8), PAGE05 FPGA Config (R5.2 S1.1)
R9_B12P_CLK7P_B4: PAGE04 FPGA CLOCK (P1.R9), PAGE09 Connectors (J4.48)
R10_B16P_B4: PAGE03 FPGA IO (P1.R10), PAGE09 Connectors (J4.50)
R11_B17P_B4: PAGE03 FPGA IO (P1.R11), PAGE09 Connectors (J4.52)
R12_B18P_B4: PAGE03 FPGA IO (P1.R12), PAGE09 Connectors (J4.54)
R13_B20P_B4: PAGE03 FPGA IO (P1.R13), PAGE09 Connectors (J4.56)
SDRAM_A0: PAGE03 FPGA IO (P1.N12), PAGE07 SDRAM (U3.23)
SDRAM_A1: PAGE04 FPGA CLOCK (P1.L14), PAGE07 SDRAM (U3.24)
SDRAM_A2: PAGE03 FPGA IO (P1.L13), PAGE07 SDRAM (U3.25)
SDRAM_A3: PAGE03 FPGA IO (P1.J13), PAGE07 SDRAM (U3.26)
SDRAM_A4: PAGE03 FPGA IO (P1.J14), PAGE07 SDRAM (U3.29)
SDRAM_A5: PAGE04 FPGA CLOCK (P1.F14), PAGE07 SDRAM (U3.30)
SDRAM_A6: PAGE03 FPGA IO (P1.F13), PAGE07 SDRAM (U3.31)
SDRAM_A7: PAGE03 FPGA IO (P1.E11), PAGE07 SDRAM (U3.32)
SDRAM_A8: PAGE03 FPGA IO (P1.D14), PAGE07 SDRAM (U3.33)
SDRAM_A9: PAGE04 FPGA CLOCK (P1.C11), PAGE07 SDRAM (U3.34)
SDRAM_A10: PAGE03 FPGA IO (P1.P14), PAGE07 SDRAM (U3.22)
SDRAM_A11: PAGE03 FPGA IO (P1.D11), PAGE07 SDRAM (U3.35)
SDRAM_A12: PAGE03 FPGA IO (P1.B14), PAGE07 SDRAM (U3.36)
SDRAM_BA0: PAGE03 FPGA IO (P1.R16), PAGE07 SDRAM (U3.20)
SDRAM_BA1: PAGE03 FPGA IO (P1.R14), PAGE07 SDRAM (U3.21)
SDRAM_DQ0: PAGE03 FPGA IO (P1.N16), PAGE07 SDRAM (U3.2)
SDRAM_DQ1: PAGE03 FPGA IO (P1.N15), PAGE07 SDRAM (U3.4)
SDRAM_DQ2: PAGE03 FPGA IO (P1.L15), PAGE07 SDRAM (U3.5)
SDRAM_DQ3: PAGE03 FPGA IO (P1.L16), PAGE07 SDRAM (U3.7)
SDRAM_DQ4: PAGE03 FPGA IO (P1.K15), PAGE07 SDRAM (U3.8)
SDRAM_DQ5: PAGE03 FPGA IO (P1.K16), PAGE07 SDRAM (U3.10)
SDRAM_DQ6: PAGE03 FPGA IO (P1.J15), PAGE07 SDRAM (U3.11)
SDRAM_DQ7: PAGE03 FPGA IO (P1.J16), PAGE07 SDRAM (U3.13)
SDRAM_DQ8: PAGE03 FPGA IO (P1.C15), PAGE07 SDRAM (U3.42)
SDRAM_DQ9: PAGE03 FPGA IO (P1.C16), PAGE07 SDRAM (U3.44)
SDRAM_DQ10: PAGE03 FPGA IO (P1.D15), PAGE07 SDRAM (U3.45)
SDRAM_DQ11: PAGE03 FPGA IO (P1.D16), PAGE07 SDRAM (U3.47)
SDRAM_DQ12: PAGE03 FPGA IO (P1.F16), PAGE07 SDRAM (U3.48)
SDRAM_DQ13: PAGE03 FPGA IO (P1.F15), PAGE07 SDRAM (U3.50)
SDRAM_DQ14: PAGE03 FPGA IO (P1.D12), PAGE07 SDRAM (U3.51)
SDRAM_DQ15: PAGE03 FPGA IO (P1.C14), PAGE07 SDRAM (U3.53)
SDRAM_LDQM: PAGE03 FPGA IO (P1.G16), PAGE07 SDRAM (U3.15)
SDRAM_nSCAS: PAGE03 FPGA IO (P1.N14), PAGE07 SDRAM (U3.17)
SDRAM_nSCS: PAGE03 FPGA IO (P1.P15), PAGE07 SDRAM (U3.19)
SDRAM_nSRAS: PAGE03 FPGA IO (P1.P16), PAGE07 SDRAM (U3.18)
SDRAM_nWE: PAGE03 FPGA IO (P1.G15), PAGE07 SDRAM (U3.16)
SDRAM_SCKE: PAGE03 FPGA IO (P1.A15), PAGE07 SDRAM (U3.37)
SDRAM_SCLK: PAGE03 FPGA IO (P1.A14), PAGE07 SDRAM (U3.38)
SDRAM_UDQM: PAGE03 FPGA IO (P1.B16), PAGE07 SDRAM (U3.39)
T2_IO_B3: PAGE03 FPGA IO (P1.T2), PAGE09 Connectors (J4.16)
T3_B2N_VREF_B3: PAGE03 FPGA IO (P1.T3), PAGE09 Connectors (J4.17)
T4_PLL1_CLKOUTN_B3: PAGE03 FPGA IO (P1.T4), PAGE09 Connectors (J4.23)
T5_B6N_B3: PAGE03 FPGA IO (P1.T5), PAGE09 Connectors (J4.27)
T6_B7N_B3: PAGE03 FPGA IO (P1.T6), PAGE09 Connectors (J4.29)
T7_B8N_B3: PAGE03 FPGA IO (P1.T7), PAGE09 Connectors (J4.31)
T8_CLK14_B3: PAGE04 FPGA CLOCK (P1.T8), PAGE09 Connectors (J4.34)
T9_B12N_CLK7N_B4: PAGE04 FPGA CLOCK (P1.T9), PAGE09 Connectors (J4.47)
T10_B16N_B4: PAGE03 FPGA IO (P1.T10), PAGE09 Connectors (J4.49)
T11_B17N_B4: PAGE03 FPGA IO (P1.T11), PAGE09 Connectors (J4.51)
T12_B18N_B4: PAGE03 FPGA IO (P1.T12), PAGE09 Connectors (J4.53)
T13_B20N_B4: PAGE03 FPGA IO (P1.T13), PAGE09 Connectors (J4.55)
T14_B23P_B4: PAGE03 FPGA IO (P1.T14), PAGE09 Connectors (J4.58)
T15_B23N_B4: PAGE03 FPGA IO (P1.T15), PAGE09 Connectors (J4.57)
TCK_F: PAGE03 FPGA IO (P1.H3), PAGE05 FPGA Config (J2.1 R16.1)
TDI_F: PAGE03 FPGA IO (P1.H4), PAGE05 FPGA Config (J2.9 R19.2)
TDO_F: PAGE03 FPGA IO (P1.J4), PAGE05 FPGA Config (J2.3)
TMS_F: PAGE03 FPGA IO (P1.J5), PAGE05 FPGA Config (J2.5 R18.2)